# EAGLE design plaits_v50 (EAGLE 9.6.2)

## Sheet 1 of 5
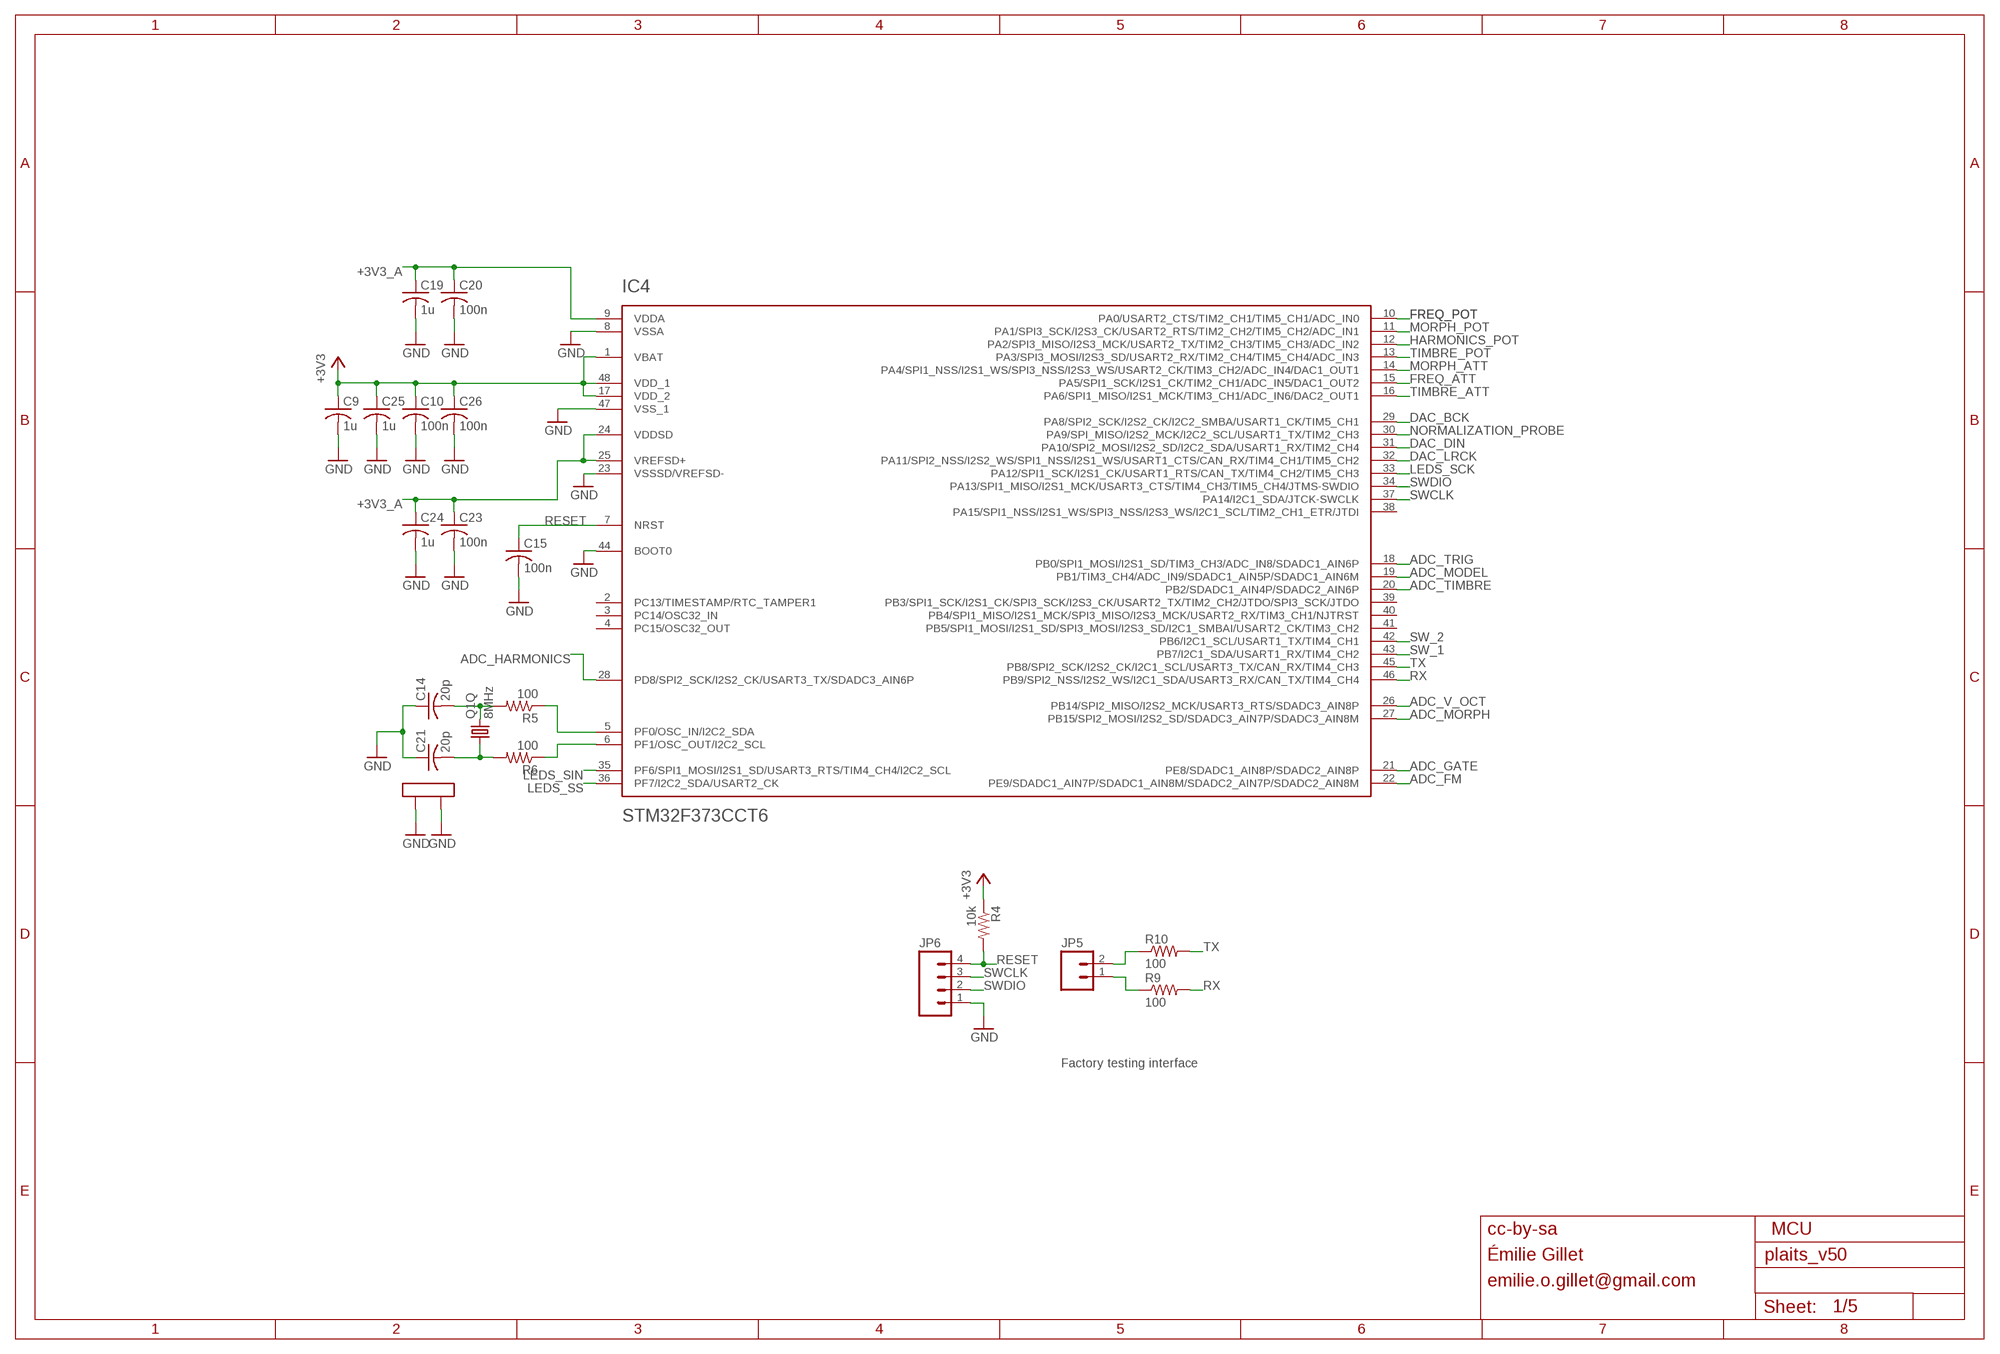
[diagram p0: schematic, sheet 1]

### Parts
C9  1u  C-USC0402  [C0402]
C10  100n  C-USC0402  [C0402]
C14  20p  C-USC0402  [C0402]
C15  100n  C-USC0402  [C0402]
C19  1u  C-USC0402  [C0402]
C20  100n  C-USC0402  [C0402]
C21  20p  C-USC0402  [C0402]
C23  100n  C-USC0402  [C0402]
C24  1u  C-USC0402  [C0402]
C25  1u  C-USC0402  [C0402]
C26  100n  C-USC0402  [C0402]
IC4  STM32F373CCT6  STM32F373C  [LQFP48]
JP5  M02PTH  [1X02]
JP6  M04PTH  [1X04]
Q1  8MHz  CRYSTAL  [CTS406]
R4  10k  R-US_R0402  [R0402]
R5  100  R-US_R0402  [R0402]
R6  100  R-US_R0402  [R0402]
R9  100  R-US_R0402  [R0402]
R10  100  R-US_R0402  [R0402]

### Nets
+3V3: C9.1 C10.1 C25.1 C26.1 IC4.1(VBAT) IC4.17(VDD_2) IC4.48(VDD_1) R4.1 ; also sheet 2,3,4,5
+3V3_A: C19.1 C20.1 C23.1 C24.1 IC4.9(VDDA) IC4.24(VDDSD) IC4.25(VREFSD+) ; also sheet 2,3,4,5
ADC_FM: IC4.22(PE9/SDADC1_AIN7P/SDADC1_AIN8M/SDADC2_AIN7P/SDADC2_AIN8M) ; also sheet 3
ADC_GATE: IC4.21(PE8/SDADC1_AIN8P/SDADC2_AIN8P) ; also sheet 3
ADC_HARMONICS: IC4.28(PD8/SPI2_SCK/I2S2_CK/USART3_TX/SDADC3_AIN6P) ; also sheet 3
ADC_MODEL: IC4.19(PB1/TIM3_CH4/ADC_IN9/SDADC1_AIN5P/SDADC1_AIN6M) ; also sheet 3
ADC_MORPH: IC4.27(PB15/SPI2_MOSI/I2S2_SD/SDADC3_AIN7P/SDADC3_AIN8M) ; also sheet 3
ADC_TIMBRE: IC4.20(PB2/SDADC1_AIN4P/SDADC2_AIN6P) ; also sheet 3
ADC_TRIG: IC4.18(PB0/SPI1_MOSI/I2S1_SD/TIM3_CH3/ADC_IN8/SDADC1_AIN6P) ; also sheet 3
ADC_V_OCT: IC4.26(PB14/SPI2_MISO/I2S2_MCK/USART3_RTS/SDADC3_AIN8P) ; also sheet 3
DAC_BCK: IC4.29(PA8/SPI2_SCK/I2S2_CK/I2C2_SMBA/USART1_CK/TIM5_CH1) ; also sheet 4
DAC_DIN: IC4.31(PA10/SPI2_MOSI/I2S2_SD/I2C2_SDA/USART1_RX/TIM2_CH4) ; also sheet 4
DAC_LRCK: IC4.32(PA11/SPI2_NSS/I2S2_WS/SPI1_NSS/I2S1_WS/USART1_CTS/CAN_RX/TIM4_CH1/TIM5_CH2) ; also sheet 4
FREQ_ATT: IC4.15(PA5/SPI1_SCK/I2S1_CK/TIM2_CH1/ADC_IN5/DAC1_OUT2) ; also sheet 2
FREQ_POT: IC4.10(PA0/USART2_CTS/TIM2_CH1/TIM5_CH1/ADC_IN0) ; also sheet 2
GND: C9.2 C10.2 C14.1 C15.2 C19.2 C20.2 C21.1 C23.2 C24.2 C25.2 C26.2 IC4.8(VSSA) IC4.23(VSSSD/VREFSD-) IC4.44(BOOT0) IC4.47(VSS_1) JP6.1 Q1.2(LID1) Q1.4(LID2) ; also sheet 2,3,4,5
HARMONICS_POT: IC4.12(PA2/SPI3_MISO/I2S3_MCK/USART2_TX/TIM2_CH3/TIM5_CH3/ADC_IN2) ; also sheet 2
LEDS_SCK: IC4.33(PA12/SPI1_SCK/I2S1_CK/USART1_RTS/CAN_TX/TIM4_CH2/TIM5_CH3) ; also sheet 2
LEDS_SIN: IC4.35(PF6/SPI1_MOSI/I2S1_SD/USART3_RTS/TIM4_CH4/I2C2_SCL) ; also sheet 2
LEDS_SS: IC4.36(PF7/I2C2_SDA/USART2_CK) ; also sheet 2
MORPH_ATT: IC4.14(PA4/SPI1_NSS/I2S1_WS/SPI3_NSS/I2S3_WS/USART2_CK/TIM3_CH2/ADC_IN4/DAC1_OUT1) ; also sheet 2
MORPH_POT: IC4.11(PA1/SPI3_SCK/I2S3_CK/USART2_RTS/TIM2_CH2/TIM5_CH2/ADC_IN1) ; also sheet 2
N$7: IC4.5(PF0/OSC_IN/I2C2_SDA) R5.1
N$8: IC4.6(PF1/OSC_OUT/I2C2_SCL) R6.1
N$29: C14.2 Q1.3 R5.2
N$33: JP5.2 R10.1
N$35: C21.2 Q1.1 R6.2
N$51: JP5.1 R9.1
NORMALIZATION_PROBE: IC4.30(PA9/SPI_MISO/I2S2_MCK/I2C2_SCL/USART1_TX/TIM2_CH3) ; also sheet 3
RESET: C15.1 IC4.7(NRST) JP6.4 R4.2
RX: IC4.46(PB9/SPI2_NSS/I2S2_WS/I2C1_SDA/USART3_RX/CAN_TX/TIM4_CH4) R9.2
SW_1: IC4.43(PB7/I2C1_SDA/USART1_RX/TIM4_CH2) ; also sheet 2
SW_2: IC4.42(PB6/I2C1_SCL/USART1_TX/TIM4_CH1) ; also sheet 2
SWCLK: IC4.37(PA14/I2C1_SDA/JTCK-SWCLK) JP6.3
SWDIO: IC4.34(PA13/SPI1_MISO/I2S1_MCK/USART3_CTS/TIM4_CH3/TIM5_CH4/JTMS-SWDIO) JP6.2
TIMBRE_ATT: IC4.16(PA6/SPI1_MISO/I2S1_MCK/TIM3_CH1/ADC_IN6/DAC2_OUT1) ; also sheet 2
TIMBRE_POT: IC4.13(PA3/SPI3_MOSI/I2S3_SD/USART2_RX/TIM2_CH4/TIM5_CH4/ADC_IN3) ; also sheet 2
TX: IC4.45(PB8/SPI2_SCK/I2S2_CK/I2C1_SCL/USART3_TX/CAN_RX/TIM4_CH3) R10.2
Unconnected: IC4.2(PC13/TIMESTAMP/RTC_TAMPER1) IC4.3(PC14/OSC32_IN) IC4.4(PC15/OSC32_OUT) IC4.38(PA15/SPI1_NSS/I2S1_WS/SPI3_NSS/I2S3_WS/I2C1_SCL/TIM2_CH1_ETR/JTDI) IC4.39(PB3/SPI1_SCK/I2S1_CK/SPI3_SCK/I2S3_CK/USART2_TX/TIM2_CH2/JTDO/SPI3_SCK/JTDO) IC4.40(PB4/SPI1_MISO/I2S1_MCK/SPI3_MISO/I2S3_MCK/USART2_RX/TIM3_CH1/NJTRST) IC4.41(PB5/SPI1_MOSI/I2S1_SD/SPI3_MOSI/I2S3_SD/I2C1_SMBAI/USART2_CK/TIM3_CH2)

### Notes on the sheet
- Factory testing interface
- cc-by-sa | MCU
- Émilie Gillet
- emilie.o.gillet@gmail.com

## Sheet 2 of 5
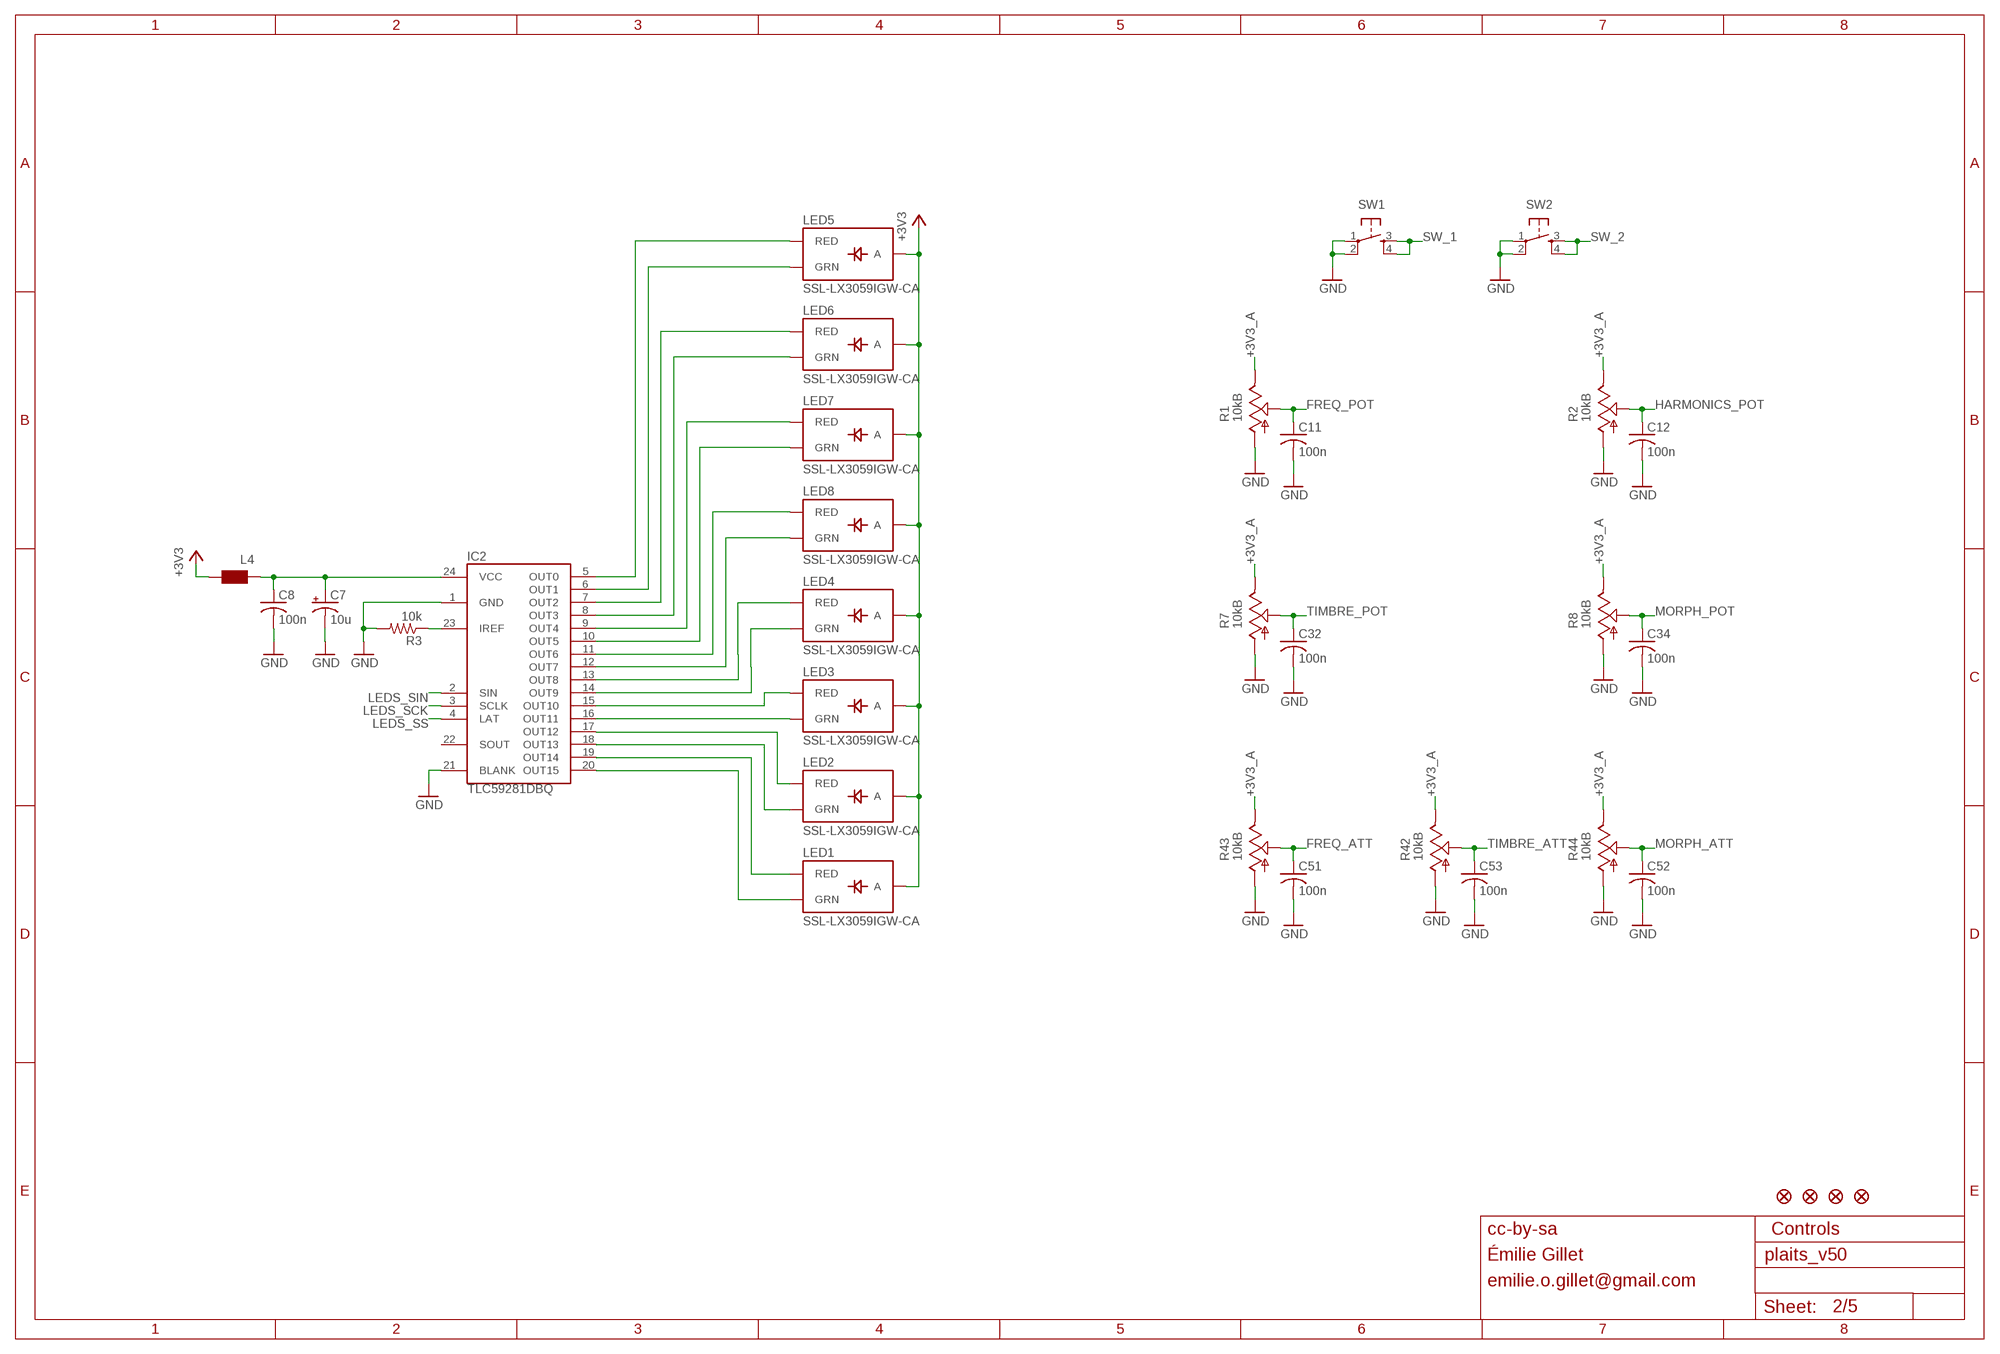
[diagram p1: schematic, sheet 2]

### Parts
C7  10u  CPOL-USA  [PANASONIC_A]
C8  100n  C-USC0402  [C0402]
C11  100n  C-USC0402  [C0402]
C12  100n  C-USC0402  [C0402]
C32  100n  C-USC0402  [C0402]
C34  100n  C-USC0402  [C0402]
C51  100n  C-USC0402  [C0402]
C52  100n  C-USC0402  [C0402]
C53  100n  C-USC0402  [C0402]
IC2  TLC59281DBQ  [TSSOP24_0635]
JP1  FIDUCIAL1X2  [FIDUCIAL-1X2]
JP2  FIDUCIAL1X2  [FIDUCIAL-1X2]
JP3  FIDUCIAL1X2  [FIDUCIAL-1X2]
JP4  FIDUCIAL1X2  [FIDUCIAL-1X2]
L4  WE-CBF_0603  [0603]
LED1  SSL-LX3059IGW-CA  LED-BICOLOR-THROUGHHOLE-CA  [LED-BICOLOR-THROUGHHOLE-LUMEX]
LED2  SSL-LX3059IGW-CA  LED-BICOLOR-THROUGHHOLE-CA  [LED-BICOLOR-THROUGHHOLE-LUMEX]
LED3  SSL-LX3059IGW-CA  LED-BICOLOR-THROUGHHOLE-CA  [LED-BICOLOR-THROUGHHOLE-LUMEX]
LED4  SSL-LX3059IGW-CA  LED-BICOLOR-THROUGHHOLE-CA  [LED-BICOLOR-THROUGHHOLE-LUMEX]
LED5  SSL-LX3059IGW-CA  LED-BICOLOR-THROUGHHOLE-CA  [LED-BICOLOR-THROUGHHOLE-LUMEX]
LED6  SSL-LX3059IGW-CA  LED-BICOLOR-THROUGHHOLE-CA  [LED-BICOLOR-THROUGHHOLE-LUMEX]
LED7  SSL-LX3059IGW-CA  LED-BICOLOR-THROUGHHOLE-CA  [LED-BICOLOR-THROUGHHOLE-LUMEX]
LED8  SSL-LX3059IGW-CA  LED-BICOLOR-THROUGHHOLE-CA  [LED-BICOLOR-THROUGHHOLE-LUMEX]
R1  10kB  POT_USVERTICAL_PS  [ALPS_POT_VERTICAL_PS]
R2  10kB  POT_USVERTICAL_PS  [ALPS_POT_VERTICAL_PS]
R3  10k  R-US_R0402  [R0402]
R7  10kB  POT_USVERTICAL_PS  [ALPS_POT_VERTICAL_PS]
R8  10kB  POT_USVERTICAL_PS  [ALPS_POT_VERTICAL_PS]
R42  10kB  POT_USVERTICAL  [ALPS_POT_VERTICAL]
R43  10kB  POT_USVERTICAL  [ALPS_POT_VERTICAL]
R44  10kB  POT_USVERTICAL  [ALPS_POT_VERTICAL]
SW1  TAC_SWITCHPTH  [TACTILE-PTH]
SW2  TAC_SWITCHPTH  [TACTILE-PTH]

### Nets
+3V3: L4.2 LED1.A LED2.A LED3.A LED4.A LED5.A LED6.A LED7.A LED8.A ; also sheet 1,3,4,5
+3V3_A: R1.P$1(E) R2.P$1(E) R7.P$1(E) R8.P$1(E) R42.P$1(E) R43.P$1(E) R44.P$1(E) ; also sheet 1,3,4,5
FREQ_ATT: C51.1 R43.P$2(S) ; also sheet 1
FREQ_POT: C11.1 R1.P$2(S) ; also sheet 1
GND: C7.- C8.2 C11.2 C12.2 C32.2 C34.2 C51.2 C52.2 C53.2 IC2.1(GND) IC2.21(BLANK) R1.P$3(A) R2.P$3(A) R3.2 R7.P$3(A) R8.P$3(A) R42.P$3(A) R43.P$3(A) R44.P$3(A) SW1.1 SW1.2 SW2.1 SW2.2 ; also sheet 1,3,4,5
HARMONICS_POT: C12.1 R2.P$2(S) ; also sheet 1
LEDS_SCK: IC2.3(SCLK) ; also sheet 1
LEDS_SIN: IC2.2(SIN) ; also sheet 1
LEDS_SS: IC2.4(LAT) ; also sheet 1
MORPH_ATT: C52.1 R44.P$2(S) ; also sheet 1
MORPH_POT: C34.1 R8.P$2(S) ; also sheet 1
N$2: IC2.12(OUT7) LED8.GREEN_C(GRN)
N$5: IC2.11(OUT6) LED8.RED_C(RED)
N$9: IC2.10(OUT5) LED7.GREEN_C(GRN)
N$10: IC2.9(OUT4) LED7.RED_C(RED)
N$11: IC2.8(OUT3) LED6.GREEN_C(GRN)
N$12: IC2.13(OUT8) LED4.RED_C(RED)
N$13: IC2.7(OUT2) LED6.RED_C(RED)
N$14: IC2.14(OUT9) LED4.GREEN_C(GRN)
N$15: IC2.6(OUT1) LED5.GREEN_C(GRN)
N$17: IC2.15(OUT10) LED3.RED_C(RED)
N$18: IC2.16(OUT11) LED3.GREEN_C(GRN)
N$19: IC2.17(OUT12) LED2.RED_C(RED)
N$20: IC2.18(OUT13) LED2.GREEN_C(GRN)
N$21: IC2.19(OUT14) LED1.RED_C(RED)
N$22: IC2.5(OUT0) LED5.RED_C(RED)
N$23: IC2.20(OUT15) LED1.GREEN_C(GRN)
N$27: C7.+ C8.1 IC2.24(VCC) L4.1
N$68: IC2.23(IREF) R3.1
SW_1: SW1.3 SW1.4 ; also sheet 1
SW_2: SW2.3 SW2.4 ; also sheet 1
TIMBRE_ATT: C53.1 R42.P$2(S) ; also sheet 1
TIMBRE_POT: C32.1 R7.P$2(S) ; also sheet 1
Unconnected: IC2.22(SOUT)

### Notes on the sheet
- cc-by-sa | Controls
- Émilie Gillet
- emilie.o.gillet@gmail.com

## Sheet 3 of 5
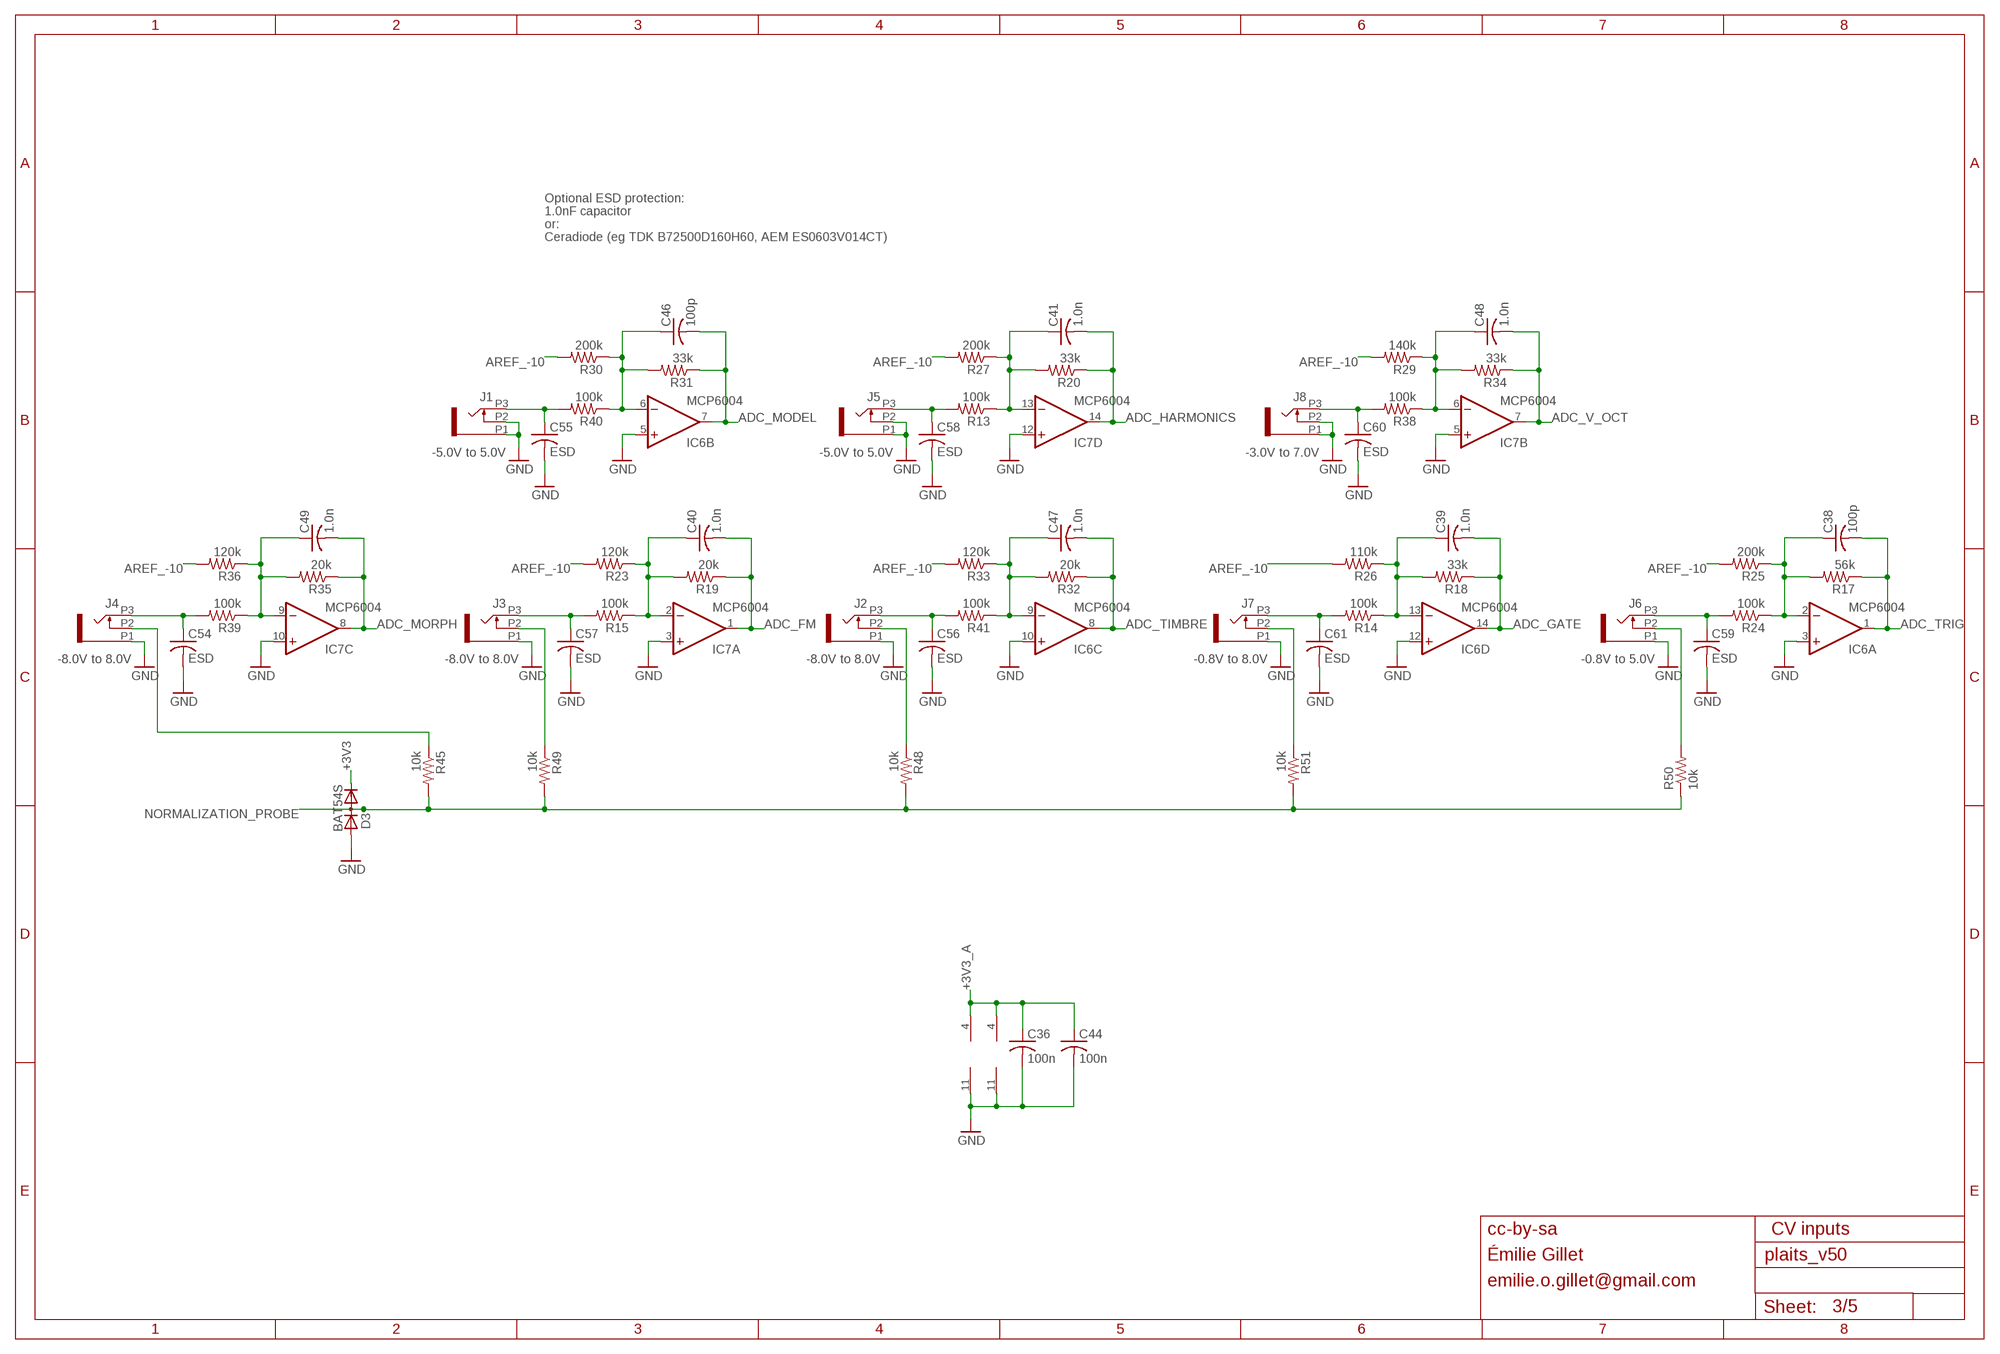
[diagram p2: schematic, sheet 3]

### Parts
C36  100n  C-USC0402  [C0402]
C38  100p  C-USC0402  [C0402]
C39  1.0n  C-USC0402  [C0402]
C40  1.0n  C-USC0402  [C0402]
C41  1.0n  C-USC0402  [C0402]
C44  100n  C-USC0402  [C0402]
C46  100p  C-USC0402  [C0402]
C47  1.0n  C-USC0402  [C0402]
C48  1.0n  C-USC0402  [C0402]
C49  1.0n  C-USC0402  [C0402]
C54  ESD  C-USC0603  [C0603]
C55  ESD  C-USC0603  [C0603]
C56  ESD  C-USC0603  [C0603]
C57  ESD  C-USC0603  [C0603]
C58  ESD  C-USC0603  [C0603]
C59  ESD  C-USC0603  [C0603]
C60  ESD  C-USC0603  [C0603]
C61  ESD  C-USC0603  [C0603]
D3  BAT54S  DIODE_2CACA-SOT23  [SOT23]
IC6  MCP6004  TL074PW  [TSSOP14_065]
IC7  MCP6004  TL074PW  [TSSOP14_065]
J1  PJ301_THONKICONN6  [WQP_PJ_301M6]
J2  PJ301_THONKICONN6  [WQP_PJ_301M6]
J3  PJ301_THONKICONN6  [WQP_PJ_301M6]
J4  PJ301_THONKICONN6  [WQP_PJ_301M6]
J5  PJ301_THONKICONN6  [WQP_PJ_301M6]
J6  PJ301_THONKICONN6  [WQP_PJ_301M6]
J7  PJ301_THONKICONN6  [WQP_PJ_301M6]
J8  PJ301_THONKICONN6  [WQP_PJ_301M6]
R13  100k  R-US_R0402  [R0402]
R14  100k  R-US_R0402  [R0402]
R15  100k  R-US_R0402  [R0402]
R17  56k  R-US_R0402  [R0402]
R18  33k  R-US_R0402  [R0402]
R19  20k  R-US_R0402  [R0402]
R20  33k  R-US_R0402  [R0402]
R23  120k  R-US_R0402  [R0402]
R24  100k  R-US_R0402  [R0402]
R25  200k  R-US_R0402  [R0402]
R26  110k  R-US_R0402  [R0402]
R27  200k  R-US_R0402  [R0402]
R29  140k  R-US_R0402  [R0402]
R30  200k  R-US_R0402  [R0402]
R31  33k  R-US_R0402  [R0402]
R32  20k  R-US_R0402  [R0402]
R33  120k  R-US_R0402  [R0402]
R34  33k  R-US_R0402  [R0402]
R35  20k  R-US_R0402  [R0402]
R36  120k  R-US_R0402  [R0402]
R38  100k  R-US_R0402  [R0402]
R39  100k  R-US_R0402  [R0402]
R40  100k  R-US_R0402  [R0402]
R41  100k  R-US_R0402  [R0402]
R45  10k  R-US_R0402  [R0402]
R48  10k  R-US_R0402  [R0402]
R49  10k  R-US_R0402  [R0402]
R50  10k  R-US_R0402  [R0402]
R51  10k  R-US_R0402  [R0402]

### Nets
+3V3: D3.2(C) ; also sheet 1,2,4,5
+3V3_A: C36.1 C44.1 IC6.4(P:V+) IC7.4(P:V+) ; also sheet 1,2,4,5
ADC_FM: C40.2 IC7.1(A:OUT) R19.1 ; also sheet 1
ADC_GATE: C39.2 IC6.14(D:OUT) R18.1 ; also sheet 1
ADC_HARMONICS: C41.2 IC7.14(D:OUT) R20.1 ; also sheet 1
ADC_MODEL: C46.2 IC6.7(B:OUT) R31.1 ; also sheet 1
ADC_MORPH: C49.2 IC7.8(C:OUT) R35.1 ; also sheet 1
ADC_TIMBRE: C47.2 IC6.8(C:OUT) R32.1 ; also sheet 1
ADC_TRIG: C38.2 IC6.1(A:OUT) R17.1 ; also sheet 1
ADC_V_OCT: C48.2 IC7.7(B:OUT) R34.1 ; also sheet 1
AREF_-10: R23.2 R25.2 R26.2 R27.2 R29.2 R30.2 R33.2 R36.2 ; also sheet 5
FM_IN: C57.1 J3.P3 R15.2
GATE_IN: C61.1 J7.P3 R14.2
GATE_IN1: C59.1 J6.P3 R24.2
GND: C36.2 C44.2 C54.2 C55.2 C56.2 C57.2 C58.2 C59.2 C60.2 C61.2 D3.1(A) IC6.3(A:+IN) IC6.5(B:+IN) IC6.10(C:+IN) IC6.11(P:V-) IC6.12(D:+IN) IC7.3(A:+IN) IC7.5(B:+IN) IC7.10(C:+IN) IC7.11(P:V-) IC7.12(D:+IN) J1.P1 J1.P2 J2.P1 J3.P1 J4.P1 J5.P1 J5.P2 J6.P1 J7.P1 J8.P1 J8.P2 ; also sheet 1,2,4,5
HARMONICS_IN: C58.1 J5.P3 R13.2
MODEL_IN: C55.1 J1.P3 R40.2
MORPH_IN: C54.1 J4.P3 R39.2
N$3: J6.P2 R50.2
N$4: C38.1 IC6.2(A:-IN) R17.2 R24.1 R25.1
N$24: J3.P2 R49.1
N$25: J2.P2 R48.1
N$26: J4.P2 R45.1
N$28: C39.1 IC6.13(D:-IN) R14.1 R18.2 R26.1
N$30: C48.1 IC7.6(B:-IN) R29.1 R34.2 R38.1
N$31: C56.1 J2.P3 R41.2
N$32: C49.1 IC7.9(C:-IN) R35.2 R36.1 R39.1
N$34: C40.1 IC7.2(A:-IN) R15.1 R19.2 R23.1
N$36: J7.P2 R51.1
N$37: C46.1 IC6.6(B:-IN) R30.1 R31.2 R40.1
N$39: C47.1 IC6.9(C:-IN) R32.2 R33.1 R41.1
N$41: C41.1 IC7.13(D:-IN) R13.1 R20.2 R27.1
NORMALIZATION_PROBE: D3.3(AC) R45.2 R48.2 R49.2 R50.1 R51.2 ; also sheet 1
V_OCT_IN: C60.1 J8.P3 R38.2

### Notes on the sheet
- Optional ESD protection:
- 1.0nF capacitor
- or:
- Ceradiode (eg TDK B72500D160H60, AEM ES0603V014CT)
- -5.0V to 5.0V | -5.0V to 5.0V | -3.0V to 7.0V
- -8.0V to 8.0V | -8.0V to 8.0V | -8.0V to 8.0V | -0.8V to 8.0V | -0.8V to 5.0V
- cc-by-sa | CV inputs
- Émilie Gillet
- emilie.o.gillet@gmail.com

## Sheet 4 of 5
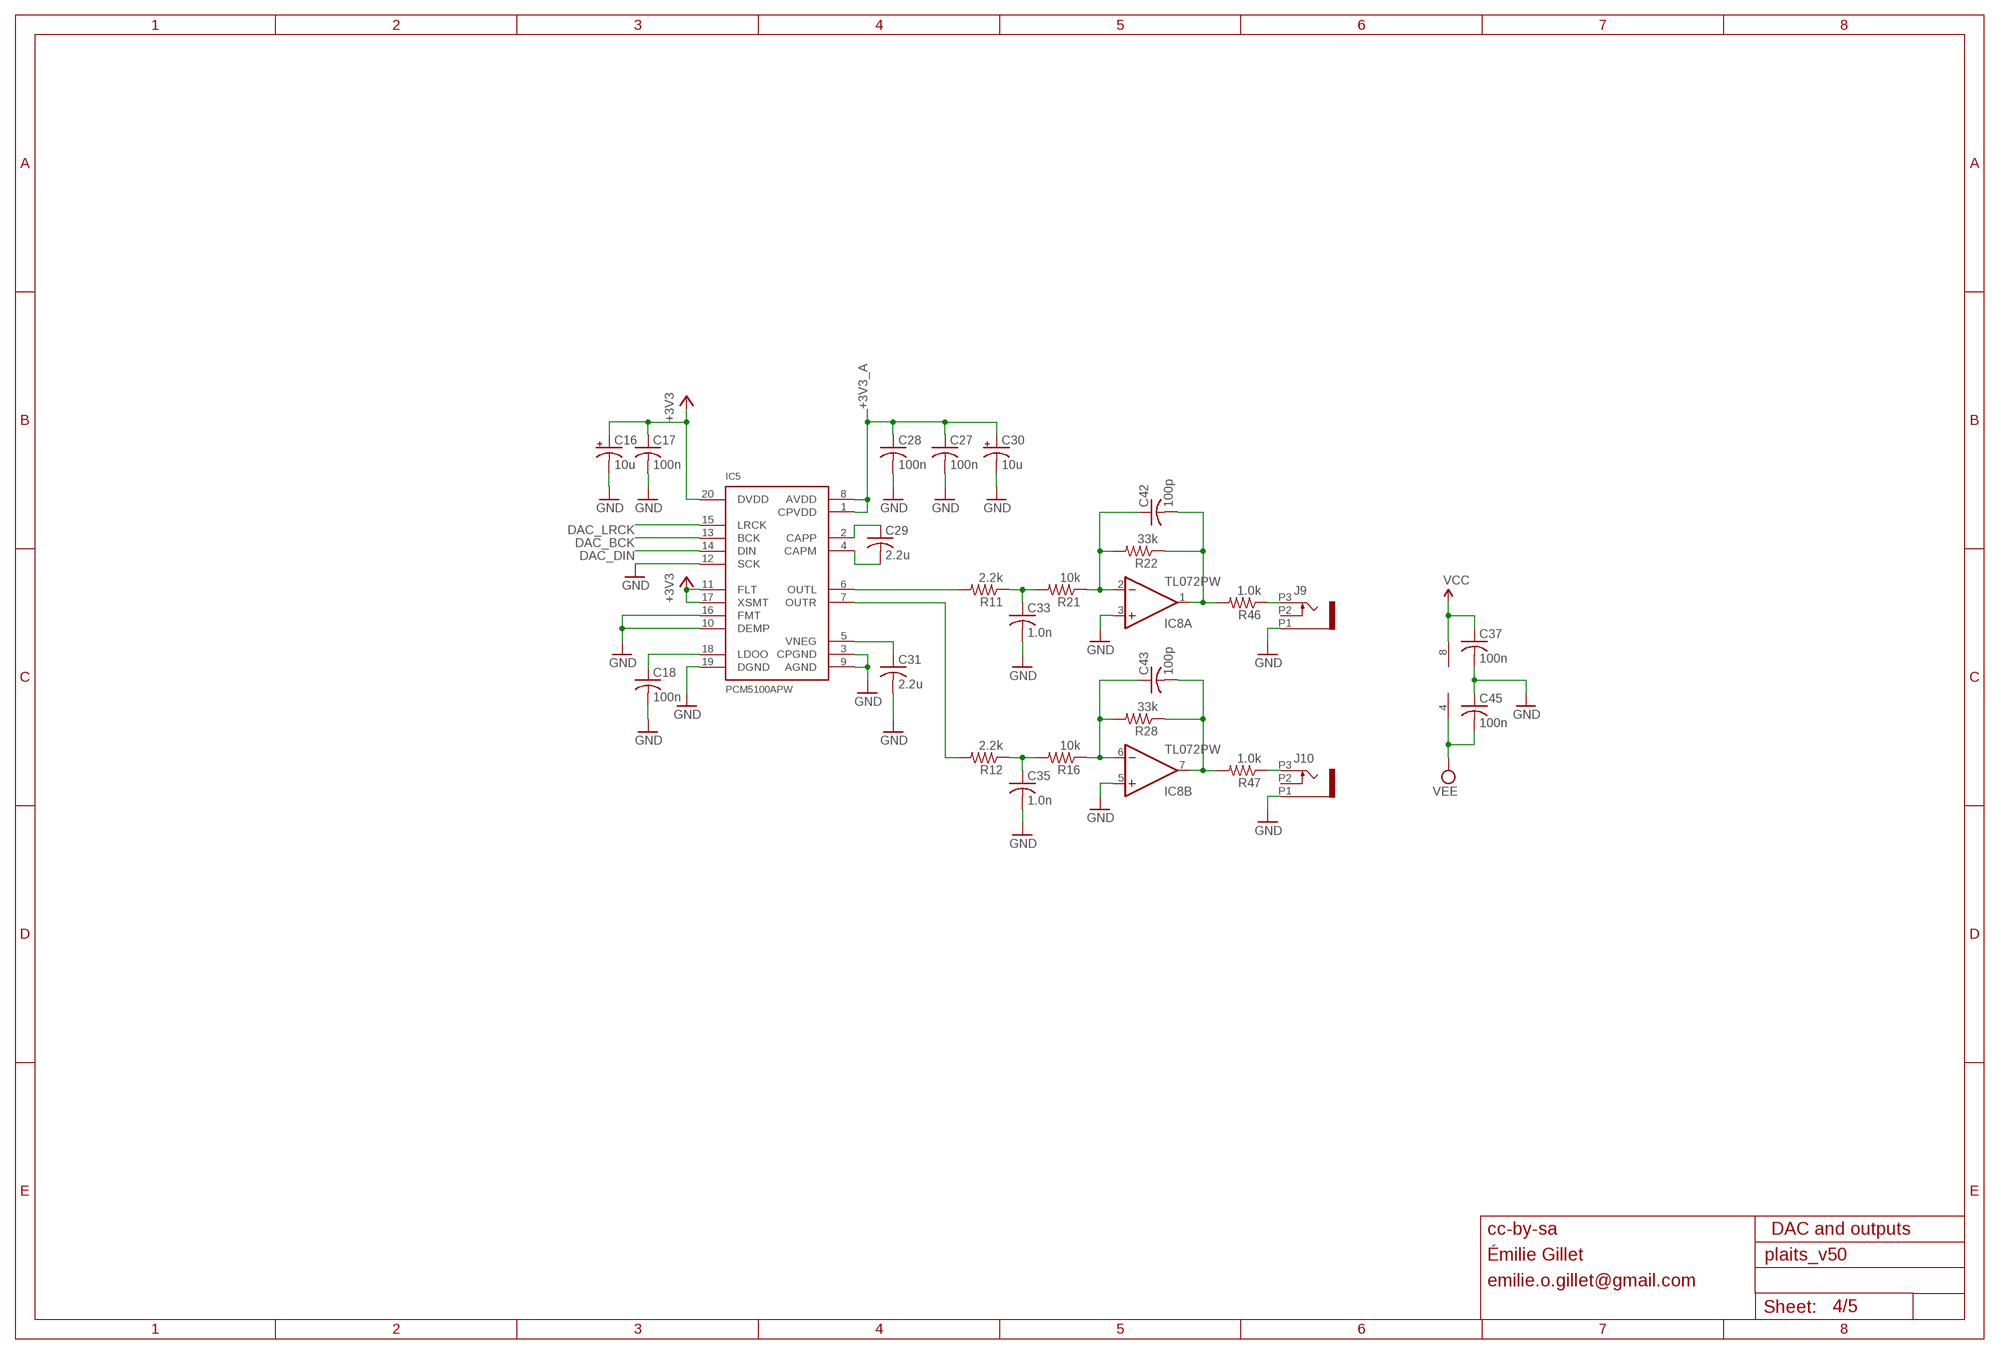
[diagram p3: schematic, sheet 4]

### Parts
C16  10u  CPOL-USA  [PANASONIC_A]
C17  100n  C-USC0402  [C0402]
C18  100n  C-USC0402  [C0402]
C27  100n  C-USC0402  [C0402]
C28  100n  C-USC0402  [C0402]
C29  2.2u  C-USC0805  [C0805]
C30  10u  CPOL-USA  [PANASONIC_A]
C31  2.2u  C-USC0805  [C0805]
C33  1.0n  C-USC0402  [C0402]
C35  1.0n  C-USC0402  [C0402]
C37  100n  C-USC0402  [C0402]
C42  100p  C-USC0402  [C0402]
C43  100p  C-USC0402  [C0402]
C45  100n  C-USC0402  [C0402]
IC5  PCM5100APW  PCM5100PW  [SSOP20]
IC8  TL072PW  [TSSOP08]
J9  PJ301_THONKICONN6  [WQP_PJ_301M6]
J10  PJ301_THONKICONN6  [WQP_PJ_301M6]
R11  2.2k  R-US_R0402  [R0402]
R12  2.2k  R-US_R0402  [R0402]
R16  10k  R-US_R0402  [R0402]
R21  10k  R-US_R0402  [R0402]
R22  33k  R-US_R0402  [R0402]
R28  33k  R-US_R0402  [R0402]
R46  1.0k  R-US_R0603  [R0603]
R47  1.0k  R-US_R0603  [R0603]

### Nets
+3V3: C16.+ C17.1 IC5.11(FLT) IC5.17(XSMT) IC5.20(DVDD) ; also sheet 1,2,3,5
+3V3_A: C27.1 C28.1 C30.+ IC5.1(CPVDD) IC5.8(AVDD) ; also sheet 1,2,3,5
DAC_BCK: IC5.13(BCK) ; also sheet 1
DAC_DIN: IC5.14(DIN) ; also sheet 1
DAC_LRCK: IC5.15(LRCK) ; also sheet 1
GND: C16.- C17.2 C18.2 C27.2 C28.2 C30.- C31.2 C33.2 C35.2 C37.2 C45.1 IC5.3(CPGND) IC5.9(AGND) IC5.10(DEMP) IC5.12(SCK) IC5.16(FMT) IC5.19(DGND) IC8.3(A:+IN) IC8.5(B:+IN) J9.P1 J10.P1 ; also sheet 1,2,3,5
N$6: C29.1 IC5.2(CAPP)
N$16: C29.2 IC5.4(CAPM)
N$43: IC5.6(OUTL) R11.2
N$46: C33.1 R11.1 R21.2
N$47: C35.1 R12.1 R16.2
N$48: C31.1 IC5.5(VNEG)
N$54: C18.1 IC5.18(LDOO)
N$55: IC5.7(OUTR) R12.2
N$58: C43.1 IC8.6(B:-IN) R16.1 R28.2
N$60: C43.2 IC8.7(B:OUT) R28.1 R47.2
N$62: C42.1 IC8.2(A:-IN) R21.1 R22.2
N$63: C42.2 IC8.1(A:OUT) R22.1 R46.2
N$65: J9.P3 R46.1
N$69: J10.P3 R47.1
VCC: C37.1 IC8.8(P:V+) ; also sheet 5
VEE: C45.2 IC8.4(P:V-) ; also sheet 5
Unconnected: J9.P2 J10.P2

### Notes on the sheet
- cc-by-sa | DAC and outputs
- Émilie Gillet
- emilie.o.gillet@gmail.com

## Sheet 5 of 5
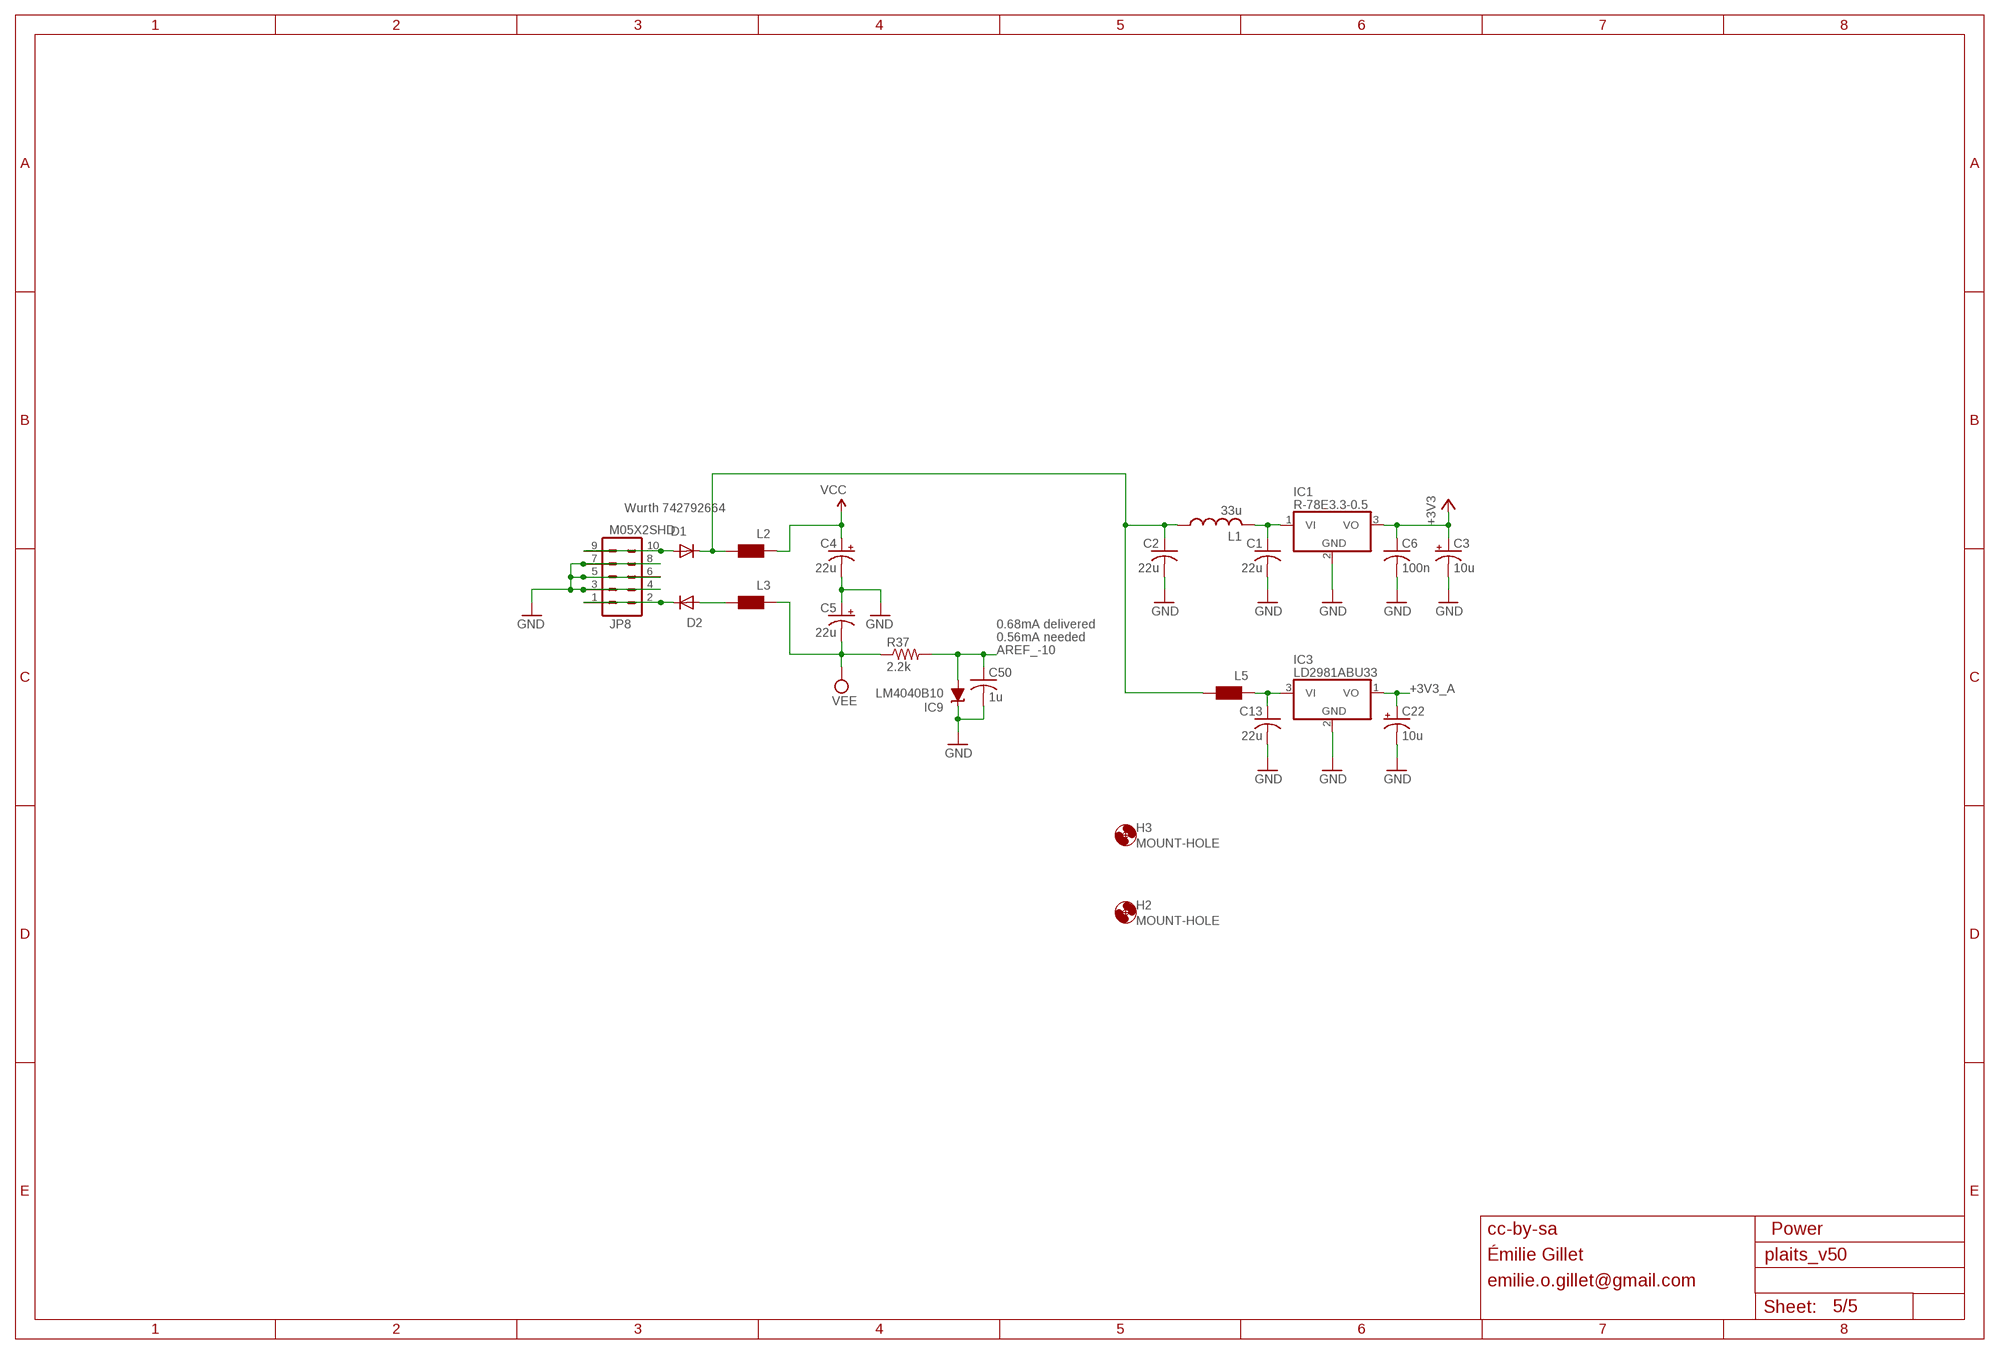
[diagram p4: schematic, sheet 5]

### Parts
C1  22u  C-USC1206  [C1206]
C2  22u  C-USC1206  [C1206]
C3  10u  CPOL-USA  [PANASONIC_A]
C4  22u  CPOL-USB  [PANASONIC_B]
C5  22u  CPOL-USB  [PANASONIC_B]
C6  100n  C-USC0402  [C0402]
C13  22u  C-USC1206  [C1206]
C22  10u  CPOL-USA  [PANASONIC_A]
C50  1u  C-USC0402  [C0402]
D1  1N5819HW  DIODE-SOD123  [SOD123]
D2  1N5819HW  DIODE-SOD123  [SOD123]
H2  MOUNT-HOLE  MOUNT-HOLE3.0TINY  [3,0TINY]
H3  MOUNT-HOLE  MOUNT-HOLE3.0TINY  [3,0TINY]
IC1  R-78E3.3-0.5  WE173950378  [WE78]
IC3  LD2981ABU33  LD2981ABU  [SOT89]
IC9  LM4040B10  LM4041B12DBZ  [DBZ_R-PDSO-G3]
JP8  M05X2SHD  [2X5-SHROUDED]
L1  33u  L-USL2012C  [L2012C]
L2  WE-CBF_0603  [0603]
L3  WE-CBF_0603  [0603]
L5  WE-CBF_0603  [0603]
R37  2.2k  R-US_R0402  [R0402]

### Nets
+3V3: C3.+ C6.1 IC1.3(VO) ; also sheet 1,2,3,4
+3V3_A: C22.+ IC3.1(VO) ; also sheet 1,2,3,4
AREF_-10: C50.1 IC9.2(A) R37.2 ; also sheet 3
GND: C1.2 C2.2 C3.- C4.- C5.+ C6.2 C13.2 C22.- C50.2 IC1.2(GND) IC3.2(GND) IC9.1(C) JP8.3 JP8.4 JP8.5 JP8.6 JP8.7 JP8.8 ; also sheet 1,2,3,4
N$1: C1.1 IC1.1(VI) L1.2
N$38: D2.A L3.2
N$40: C2.1 D1.C L1.1 L2.2 L5.2
N$42: C13.1 IC3.3(VI) L5.1
N$56: D1.A JP8.9 JP8.10
N$64: D2.C JP8.1 JP8.2
VCC: C4.+ L2.1 ; also sheet 4
VEE: C5.- L3.1 R37.1 ; also sheet 4

### Notes on the sheet
- Wurth 742792664
- 0.68mA delivered
- 0.56mA needed
- cc-by-sa | Power
- Émilie Gillet
- emilie.o.gillet@gmail.com

## Library data of the parts
C1 C2 C6 C8-C15 C17-C21 C23-C29 C31-C61 = rcl:C-US: CAPACITOR, American symbol
C3-C5 C7 C16 C22 C30 = rcl:CPOL-US: POLARIZED CAPACITOR, American symbol
D1 D2 = diode:DIODE-: DIODE
D3 = diode:DIODE_2CACA-: 2 Diodes - Cathode-Anode|Cathode-Anode
H2 H3 = og-holes:MOUNT-HOLE: MOUNTING HOLE with drill center marker
IC1 = og-vreg:WE173950378
IC2 = og-ics:TLC59281
IC3 = og-vreg:LD2981
IC4 = og-stm32f2:STM32F373C
IC5 = og-dac:PCM5100
IC6 IC7 = og-linear:TL074: OP AMP
IC8 = og-linear:TL072: OP AMP
IC9 = texas:LM4041: PRECISION MICROPOWER SHUNT VOLTAGE REFERENCE Source: http://focus.ti.com/lit/ds/slcs146e/slcs146e.pdf
J1-J10 = og-pj301_variations:PJ301_THONKICONN
JP1-JP4 = SparkFun:FIDUCIAL: Fiducial Alignment Points Various fiducial points for machine vision alignment.
JP5 = SparkFun:M02: Header 2 Standard 2-pin 0.1" header. Use with straight break away headers (SKU : PRT-00116), right angle break away headers (PRT-00553), swiss pins (PRT-00743), machine pins (PRT-00117), and female headers (PRT-00115). Molex polarized connector foot print use with SKU : PRT-08233 with associated crimp pins and housings.
JP6 = SparkFun:M04: Header 4 Standard 4-pin 0.1" header. Use with straight break away headers (SKU : PRT-00116), right angle break away headers (PRT-00553), swiss pins (PRT-00743), machine pins (PRT-00117), and female headers (PRT-00115). Molex polarized connector foot print use with SKU : PRT-08231 with associated crimp pins and housings.
JP8 = og-header:M05X2: Header 5x2 Standard 10-pin dual row 0.1" header. Commonly used with AVR-ISP. Use with Spark Fun Electronics SKU: PRT-00778
L1 = og-rcl:L-US
L2-L5 = wuerth-elektronik:WE-CBF: SMD EMI Suppression Ferrite Beads - excellent anti-EMI properties - low DCR - impedances till 3000 ohms - rated current up to 6 A
LED1-LED8 = og-leds:LED-BICOLOR-THROUGHHOLE-CA
Q1 = og-crystal:CRYSTAL: Crystal with 2 extra terminals for the metal LID (Abracon ABMM2 for example)
R1 R2 R7 R8 R42-R44 = og-pots:POT_US
R3-R6 R9-R41 R45-R51 = rcl:R-US_: RESISTOR, American symbol
SW1 SW2 = SparkFun:TAC_SWITCH: Momentary Switch Button commonly used for reset or general input. Spark Fun Electronics SKU : COM-00097

## Board
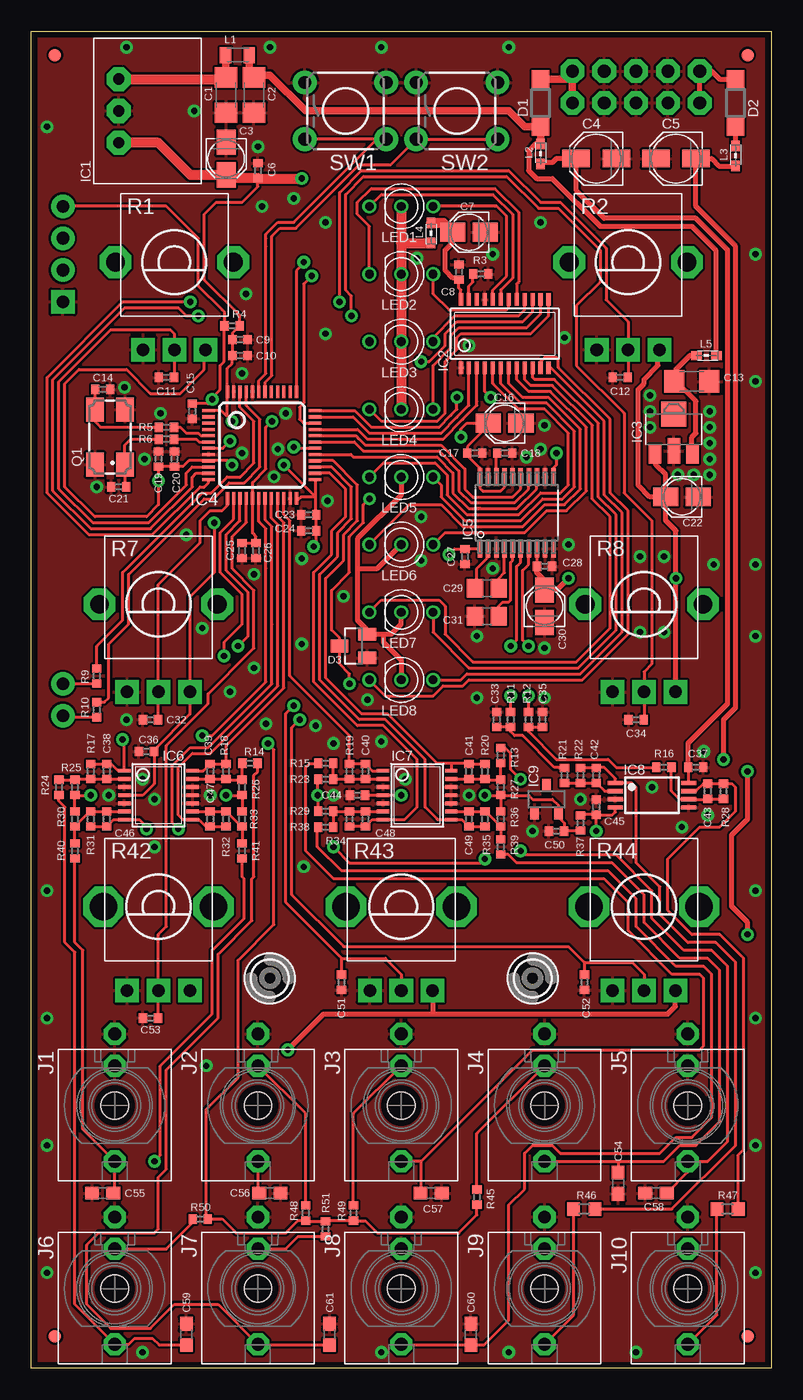
[diagram p5: board, top side]
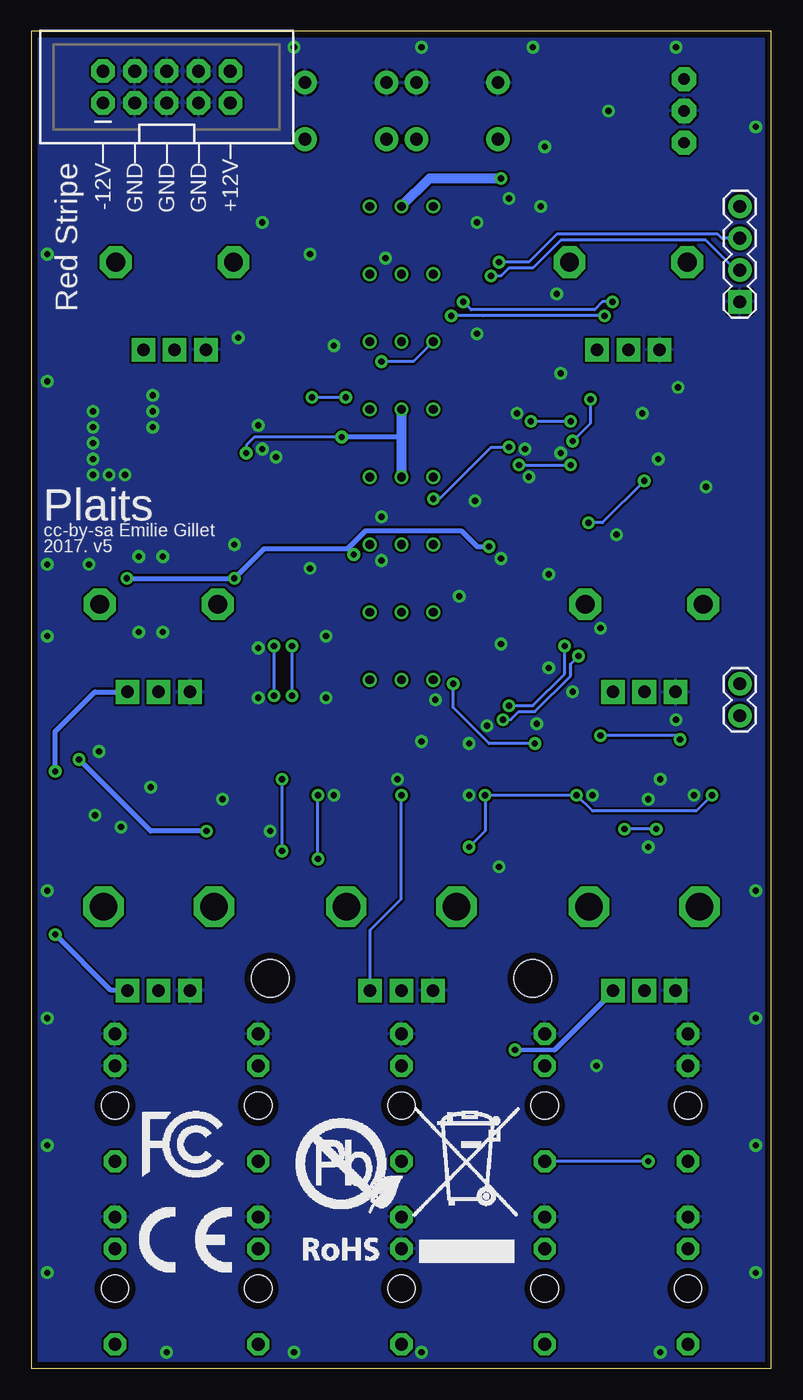
[diagram p6: board, bottom side, seen from below]

Size 59.03 x 106.68 mm. Coordinates in mm from the lower left corner, seen from the top.
Outline: 59.03,0 0,0 0,106.68 59.03,106.68 59.03,0
Copper layers (1*16): Top 0.035mm / dielectric 1.5mm / Bottom 0.035mm
Design rules "PCBCart-Standard": minimum track width 8mil, minimum drill 0.4mm, track to track 7mil, track to pad 7mil, pad to pad 7mil, via to via 7mil, smd to smd 7mil, copper to edge 20mil, drill to drill 8mil, minimum pad ring 8mil, minimum via ring 10mil, stop-mask expansion 3mil, vias tented up to drill 25mil, thermal gap 8mil

### Footprints (pad centres in the part's own frame; a part is rotated, then mirrored left to right if it is on the bottom)
C1206 = smd 1.6 x 1.8: 1 -1.4,0; 2 1.4,0
PANASONIC_A = smd 2 x 1.5: + 1.3,0; - -1.3,0
PANASONIC_B = smd 2.2 x 1.4: + 1.6,0; - -1.6,0
C0402 = smd 0.65 x 0.75: 1 -0.6,0; 2 0.6,0
C0805 = smd 1.3 x 1.5: 1 -0.95,0; 2 0.95,0
C0603 = smd 1.1 x 1: 1 -0.85,0; 2 0.85,0
SOD123 = smd 1.4 x 1.4: A 1.9,0; C -1.9,0
SOT23 = smd 1 x 1.4: 1 -0.95,-1.1; 2 0.95,-1.1; 3 0,1.1
3,0TINY = hole 3: 0,0
WE78 = drill 0.9 pad 1.93 octagon: 1 -2.54,0; 2 0,0; 3 2.54,0
TSSOP24_0635 = smd 0.33 x 1: 1 -3.493,-2.725; 2 -2.857,-2.725; 3 -2.223,-2.725; 4 -1.587,-2.725; 5 -0.953,-2.725; 6 -0.318,-2.725; 7 0.318,-2.725; 8 0.953,-2.725; 9 1.587,-2.725; 10 2.223,-2.725; 11 2.857,-2.725; 12 3.493,-2.725; 13 3.493,2.725; 14 2.857,2.725; 15 2.223,2.725; 16 1.587,2.725; 17 0.953,2.725; 18 0.318,2.725; 19 -0.318,2.725; 20 -0.953,2.725; 21 -1.587,2.725; 22 -2.223,2.725; 23 -2.857,2.725; 24 -3.493,2.725
SOT89 = smd 1 x 1.5: 1 -1.499,-1.981; 3 1.499,-1.981 | smd 1 x 2: 2 0,-1.727 | smd 2 x 2: 2@1 0,1.194
LQFP48 = smd 0.254 x 1: 1 -2.75,-4.25; 2 -2.25,-4.25; 3 -1.75,-4.25; 4 -1.25,-4.25; 5 -0.75,-4.25; 6 -0.25,-4.25; 7 0.25,-4.25; 8 0.75,-4.25; 9 1.25,-4.25; 10 1.75,-4.25; 11 2.25,-4.25; 12 2.75,-4.25; 25 2.75,4.25; 26 2.25,4.25; 27 1.75,4.25; 28 1.25,4.25; 29 0.75,4.25; 30 0.25,4.25; 31 -0.25,4.25; 32 -0.75,4.25; 33 -1.25,4.25; 34 -1.75,4.25; 35 -2.25,4.25; 36 -2.75,4.25 | smd 1 x 0.254: 13 4.25,-2.75; 14 4.25,-2.25; 15 4.25,-1.75; 16 4.25,-1.25; 17 4.25,-0.75; 18 4.25,-0.25; 19 4.25,0.25; 20 4.25,0.75; 21 4.25,1.25; 22 4.25,1.75; 23 4.25,2.25; 24 4.25,2.75; 37 -4.25,2.75; 38 -4.25,2.25; 39 -4.25,1.75; 40 -4.25,1.25; 41 -4.25,0.75; 42 -4.25,0.25; 43 -4.25,-0.25; 44 -4.25,-0.75; 45 -4.25,-1.25; 46 -4.25,-1.75; 47 -4.25,-2.25; 48 -4.25,-2.75
SSOP20 = smd 1.422 x 0.356: 1 -2.845,2.936; 2 -2.845,2.276; 3 -2.845,1.615; 4 -2.845,0.98; 5 -2.845,0.32; 6 -2.845,-0.315; 7 -2.845,-0.98; 8 -2.845,-1.615; 9 -2.845,-2.276; 10 -2.845,-2.936; 11 2.845,-2.936; 12 2.845,-2.276; 13 2.845,-1.615; 14 2.845,-0.98; 15 2.845,-0.315; 16 2.845,0.32; 17 2.845,0.98; 18 2.845,1.615; 19 2.845,2.276; 20 2.845,2.936
TSSOP14_065 = smd 0.305 x 0.991: 1 -1.95,-2.718; 2 -1.3,-2.718; 3 -0.65,-2.718; 4 0,-2.718; 5 0.65,-2.718; 6 1.3,-2.718; 7 1.95,-2.718; 8 1.95,2.718; 9 1.3,2.718; 10 0.65,2.718; 11 0,2.718; 12 -0.65,2.718; 13 -1.3,2.718; 14 -1.95,2.718
TSSOP08 = smd 0.35 x 1.2: 1 -0.975,-2.925; 2 -0.325,-2.925; 3 0.325,-2.925; 4 0.975,-2.925; 5 0.975,2.925; 6 0.325,2.925; 7 -0.325,2.925; 8 -0.975,2.925
DBZ_R-PDSO-G3 = smd 0.7 x 1: 1 -0.95,-1.1; 2 0.95,-1.1; 3 0,1.1
WQP_PJ_301M6 = drill 1.016 pad 1.778 octagon: P1 0,-5.715; P2 0,-3.175; P3 0,4.445 | hole 2.2: 0,0
FIDUCIAL-1X2 = smd 1 x 1: 1 0,0
1X02 = drill 1.016 pad 1.88: 1 0,0; 2 2.54,0
1X04 = drill 1.016 pad 1.88 square: 1 0,0 | drill 1.016 pad 1.88: 2 2.54,0; 3 5.08,0; 4 7.62,0
2X5-SHROUDED = drill 1.016 pad 1.88 octagon: 1 -1.27,5.08; 2 1.27,5.08; 3 -1.27,2.54; 4 1.27,2.54; 5 -1.27,0; 6 1.27,0; 7 -1.27,-2.54; 8 1.27,-2.54; 9 -1.27,-5.08; 10 1.27,-5.08
L2012C = smd 0.9 x 1.25: 1 -0.9,0; 2 1,0
0603 = smd 0.85 x 0.7: 1 -0.9,0; 2 0.7,0
LED-BICOLOR-THROUGHHOLE-LUMEX = drill 0.7: A 0,0; GREEN_C 2.54,0; RED_C -2.54,0
CTS406 = smd 1.9 x 1.4: 1 -2.2,-1.2; 2 2.2,-1.2; 3 2.2,1.2; 4 -2.2,1.2
ALPS_POT_VERTICAL_PS = drill 1 pad 1.88 square: P$1 -2.5,7; P$2 0,7; P$3 2.5,7 | drill 1.5 pad 2.54 octagon: P$4 -4.7,0; P$5 4.7,0
R0402 = smd 0.65 x 0.75: 1 -0.6,0; 2 0.6,0
ALPS_POT_VERTICAL = drill 1 pad 1.88 square: P$1 -2.5,6.7; P$2 0,6.7; P$3 2.5,6.7 | drill 2.2 pad 3.175 octagon: P$4 -4.4,0; P$5 4.4,0
R0603 = smd 1 x 1.1: 1 -0.85,0; 2 0.85,0
TACTILE-PTH = drill 1.016 pad 1.88: 1 -3.251,2.261; 2 3.251,2.261; 3 -3.251,-2.261; 4 3.251,-2.261

### Placement (x,y rotation side)
C1  15.54,101.6 270 top
C2  17.76,101.6 270 top
C3  15.54,96.52 270 top
C4  45.06,96.52 180 top
C5  51.41,96.52 180 top
C6  18.08,95.57 90 top
C7  34.91,90.65 180 top
C8  34.11,87.47 90 top
C9  16.65,82.07 0 top
C10  16.65,80.8 0 top
C11  10.78,79.06 180 top
C12  46.97,79.06 180 top
C13  52.68,78.74 0 top
C14  5.7,78.11 180 top
C15  12.84,76.36 270 top
C16  37.76,75.41 180 top
C17  35.38,73.03 0 top
C18  37.76,73.02 0 top
C19  10.14,72.55 90 top
C20  11.41,72.55 90 top
C21  6.97,70.33 0 top
C22  51.89,69.53 180 top
C23  22.13,68.1 180 top
C24  22.13,66.83 180 top
C25  16.81,65.25 270 top
C26  17.92,65.25 270 top
C27  34.59,64.77 270 top
C28  40.94,63.98 0 top
C29  36.33,62.23 0 top
C30  40.94,60.8 90 top
C31  36.33,60.01 180 top
C32  9.51,51.75 180 top
C33  37.13,51.75 90 top
C34  48.24,51.75 180 top
C35  40.78,51.75 90 top
C36  9.19,49.21 180 top
C37  53,47.94 0 top
C38  6.01,47.62 90 top
C39  14.27,47.62 90 top
C40  26.65,47.62 90 top
C41  34.9,47.62 90 top
C42  45.06,47.31 90 top
C43  53.95,46.04 90 top
C44  26.02,45.72 180 top
C45  45.06,44.77 270 top
C46  6.01,43.81 270 top
C47  14.27,43.81 270 top
C48  26.65,43.81 270 top
C49  34.9,43.81 270 top
C50  41.89,42.86 180 top
C51  24.75,30.8 270 top
C52  44.11,30.8 270 top
C53  9.51,27.94 180 top
C54  46.81,14.76 270 top
C55  5.7,13.97 180 top
C56  19.03,13.97 0 top
C57  31.89,13.97 0 top
C58  49.83,13.97 180 top
C59  12.36,2.7 90 top
C60  35.06,2.7 90 top
C61  23.79,2.7 90 top
D1  40.62,100.97 90 top
D2  56.18,100.97 270 top
D3  25.7,57.63 90 top
H2  39.98,31.12 0 top
H3  19.03,31.11 0 top
IC1  6.97,100.33 270 top
IC2  37.76,82.55 0 top
IC3  51.26,74.93 0 top
IC4  18.39,73.66 270 top
IC5  38.72,68.26 90 top
IC6  10.14,45.72 270 top
IC7  30.78,45.72 270 top
IC8  49.51,45.72 270 top
IC9  41.1,45.4 0 top
J1  6.65,20.95 180 top
J2  18.08,20.95 180 top
J3  29.51,20.95 180 top
J4  40.94,20.95 180 top
J5  52.37,20.95 180 top
J6  6.65,6.35 180 top
J7  18.08,6.35 180 top
J8  29.51,6.35 180 top
J9  40.94,6.35 180 top
J10  52.37,6.35 180 top
JP1  1.89,104.78 0 top
JP2  57.13,104.78 0 top
JP3  1.89,2.54 0 top
JP4  57.13,2.54 0 top
JP5  2.52,54.61 270 bottom
JP6  2.52,85.09 90 bottom
JP8  48.24,102.23 90 bottom
L1  16.49,104.78 180 top
L2  40.62,97 90 top
L3  56.18,96.84 90 top
L4  31.89,90.49 270 top
L5  53.95,80.8 0 top
LED1  29.51,92.71 0 top
LED2  29.51,87.31 0 top
LED3  29.51,81.92 0 top
LED4  29.51,76.52 0 top
LED5  29.51,71.12 0 top
LED6  29.51,65.72 0 top
LED7  29.51,60.33 0 top
LED8  29.51,54.93 0 top
Q1  6.28,74.3 90 top
R1  11.41,88.27 180 top
R2  47.6,88.27 180 top
R3  35.86,87.31 0 top
R4  16.01,83.19 180 top
R5  10.78,75.09 180 top
R6  10.78,74.14 180 top
R7  10.14,60.96 180 top
R8  48.88,60.96 180 top
R9  5.22,55.24 90 top
R10  5.22,52.55 90 top
R11  38.24,51.75 90 top
R12  39.67,51.75 90 top
R13  37.45,48.9 90 top
R14  17.44,48.26 0 top
R15  23.48,48.26 180 top
R16  50.46,47.94 180 top
R17  4.74,47.62 270 top
R18  15.54,47.62 270 top
R19  25.38,47.62 270 top
R20  36.17,47.62 270 top
R21  42.52,47.31 90 top
R22  43.79,47.31 270 top
R23  23.48,46.99 180 top
R24  2.2,46.35 270 top
R25  3.47,46.35 270 top
R26  16.81,46.35 270 top
R27  37.45,46.35 270 top
R28  55.22,46.04 270 top
R29  23.48,44.45 180 top
R30  3.47,43.81 90 top
R31  4.74,43.81 90 top
R32  15.54,43.81 90 top
R33  16.81,43.81 90 top
R34  25.38,43.81 90 top
R35  36.17,43.81 90 top
R36  37.45,43.81 90 top
R37  43.79,43.5 270 top
R38  23.48,43.18 180 top
R39  37.45,41.59 270 top
R40  3.47,41.27 270 top
R41  16.81,41.27 270 top
R42  10.14,36.83 180 top
R43  29.51,36.83 180 top
R44  48.88,36.83 180 top
R45  35.54,13.65 270 top
R46  44.11,12.7 0 top
R47  55.54,12.7 0 top
R48  21.89,12.38 270 top
R49  25.7,12.38 270 top
R50  13.47,11.91 180 top
R51  23.48,11.11 90 top
SW1  25.06,100.33 0 top
SW2  33.95,100.33 0 top
U$1  [FCC_MEDIUM]  50.14,15.24 0 bottom
U$2  [ROHS_BIG]  39.19,7.62 0 bottom
U$3  [CE_MEDIUM]  50.46,7.62 0 bottom

### Tracks (layer width: path | path; a pad name or v marks a point on that pad's centre or on a via)
+3V3  (via drill 0.5)
  Top 0.254: IC5.17 37.76,71.08 37.76,70.33 37.45,70.01 36.02,70.01 35.78,70.25 IC5.20 | IC5.20 35.77,71.12 | IC5.20 35.78,71.36 | C25.1 C26.1 17.92,66.36 17.64,66.63 IC4.17 17.64,70.69 18.71,71.75 18.71,75.09 v19.19,75.56 | v16.01,75.56 15.64,75.93 | 15.64,75.93 IC4.48 15.64,79.8 16.01,80.17 16.01,80.77 C10.1 | v34.27,74.3 34.27,74.93 34.75,75.41 C16.+ 36.46,75.22 34.78,73.54 C17.1 34.9,72.9 34.9,72.71 35.78,71.83 IC5.20 | 17.8,94.97 C6.1 18.08,94.3 16.81,93.03 14.74,93.03 13.79,92.08 13.79,86.84 16.61,84.01 R4.1 16.05,82.62 C9.1 C10.1 | C10.1 | IC5.20 35.78,71.52 | v41.89,73.03 41.89,72.07 41.65,71.83 IC5.11 | 15.64,75.93 15.17,76.41 IC4.1
  Top 0.406: LED5.A 29.51,69.69 26.02,66.2 26.02,63.82 | LED6.A 27.6,63.82 26.02,63.82 | 26.02,63.82 26.02,59.69 26.8,58.91 D3.2 28.08,58.58 | LED7.A 29.51,59.37 28.71,58.58 28.08,58.58 | LED8.A 29.51,56.52 28.08,57.94 28.08,58.58
  Top 0.813: LED4.A LED3.A LED2.A 29.51,89.79 | IC1.3 10.14,97.79 12.71,95.22 C3.+ 15.84,94.92 15.89,94.97 C6.1 18.11,94.93 v21.57,94.93 21.55,94.92 | 29.51,89.79 L4.2 | LED1.A 29.51,89.79
  Bottom 0.254: v34.27,74.3 41.25,74.3 41.89,73.66 v41.89,73.03 | v19.19,75.56 v16.01,75.56
  Bottom 0.406: 29.51,74.3 v34.27,74.3
  Bottom 0.813: LED4.A 29.51,74.3 LED5.A | LED1.A 27.29,94.93 v21.57,94.93
+3V3_A  (via drill 0.5)
  Top 0.254: v14.59,67.47 14.59,63.5 12.64,61.55 R7.P$1 | IC5.1 34.63,65.42 C27.1 33.76,65.37 v33.32,64.93 | R1.P$1 13.79,81.15 13.79,79.69 11.89,77.79 9.51,77.79 7.6,79.69 3.79,79.69 2.68,78.58 2.68,70.33 5.06,67.94 9.19,67.94 10.14,68.9 v10.14,70.8 C19.1 C20.1 12.08,71.95 12.54,72.41 IC4.9 15.68,72.41 v16.01,72.07 | IC4.24 21.26,69.29 21.5,69.53 22.68,69.53 | v20.14,72.07 | 22.68,69.53 v20.14,72.07 | R7.P$1 12.68,53.92 | R7.P$1 12.64,52.19 9.79,49.34 C36.1 9.79,46.64 8.87,45.72 IC6.4 | IC4.25 22.68,70.87 22.68,69.53 | v22.52,65.56 22.73,65.77 C24.1 C23.1 22.68,68.15 22.68,69.53 | IC5.8 C28.1 | C44.1 IC7.4 v29.51,45.72
  Top 0.406: R8.P$1 51.41,54 v51.41,63.02 51.41,66.83 50.59,67.66 50.59,68.9 | 32.05,28.26 23.32,28.26 v20.46,25.4 | 32.05,28.26 50.78,28.26 51.38,28.85 R44.P$1 | R43.P$1 32.05,30.09 32.05,28.26 | v57.13,47.62 57.13,43.81 55.86,42.55 55.86,36.83 57.13,35.56 v57.13,34.61 | C30.+ 41.07,62.23 | v42.84,63.02 41.92,62.1 C30.+ | C28.1 40.3,63.94 40.3,63.5 40.94,62.87 C30.+ | 50.59,68.9 C22.+ | C22.+ 50.62,69.56 | R2.P$1 49.99,81.15 49.99,80.01 48.88,78.9 48.88,78.58 | 48.4,78.11 48.88,78.58 | 48.4,78.11 48.4,70.48 49.35,69.53 C22.+ | IC3.1 49.83,72.95 49.83,72.07 50.59,71.31 50.59,68.9 | 48.4,78.11 48.88,78.58
  Bottom 0.254: 33.79,65.41 v33.32,64.93 | v10.14,70.8 13.47,67.47 v14.59,67.47 | v29.51,45.72 29.51,37.47 32.01,34.97 R43.P$1 | v20.14,72.07 v16.01,72.07
  Bottom 0.356: 17.28,25.4 v20.46,25.4
  Bottom 0.406: v51.41,63.02 v42.84,63.02 40.46,65.41 33.79,65.41 32.36,66.83 24.75,66.83 23.48,65.56 v22.52,65.56 | R44.P$1 51.41,30.16 52.68,30.16 v57.13,34.61 | v57.13,47.62 57.13,50.8 53.97,53.96 R8.P$1 | 17.28,25.4 12.64,30.04 R42.P$1
ADC_FM
  Top 0.254: IC4.22 20.14,68.1 20.62,67.63 20.62,55.24 25.38,50.48 25.38,50.16 25.38,49.69 R19.1 C40.2 27.21,47.67 IC7.1
ADC_GATE
  Top 0.254: IC4.21 19.64,67.97 20.14,67.47 20.14,54.29 15.54,49.69 15.54,49.37 R18.1 C39.2 13.71,47.67 IC6.14
ADC_HARMONICS
  Top 0.254: C41.2 R20.1 | C41.2 34.9,48.26 | 33.48,48.27 32.35,48.27 28.4,52.23 26.33,52.23 23.48,55.09 23.48,63.02 24.9,64.45 24.9,66.52 26.02,67.63 26.02,70.48 24.09,72.41 IC4.28 | C41.2 34.85,48.27 33.48,48.27 | 33.48,48.27 33.49,48.26 IC7.14
ADC_MODEL  (via drill 0.5)
  Top 0.254: v11.73,43.02 11.25,43.5 11.25,48.1 12.68,49.53 14.11,49.53 19.19,54.61 | v9.19,43.02 9.19,43.18 8.6,43.77 IC6.7 6.57,43.77 C46.2 R31.1 | 19.19,54.61 19.19,59.37 19.19,67.15 18.64,67.69 IC4.19 | 19.19,54.61
  Bottom 0.254: v9.19,43.02 v11.73,43.02
ADC_MORPH
  Top 0.254: R35.1 C49.2 34.35,43.77 IC7.8 32.41,43.77 32.36,43.81 31.41,44.77 31.41,48.58 28.24,51.75 26.17,51.75 23,54.93 23,63.34 24.43,64.77 24.43,66.67 25.54,67.79 25.54,70.33 23.96,71.91 IC4.27
ADC_TIMBRE
  Top 0.254: IC4.20 19.14,67.83 19.66,67.31 19.66,54.45 15.22,50.01 14.74,49.53 14.27,49.05 12.84,49.05 11.73,47.94 11.73,47.62 11.73,44.13 12.09,43.77 IC6.8 13.36,43.77 13.92,43.22 C47.2 R32.1
ADC_TRIG  (via drill 0.5)
  Top 0.254: v7.28,50.16 7.42,50.02 IC6.1 6.92,47.67 6.33,48.26 6.33,48.23 C38.2 R17.1 | IC4.18 18.14,67.56 18.71,66.99 18.71,63.82 18.71,54.77 | v13.63,50.48 14.43,50.48 18.71,54.77 | 18.71,54.77
  Bottom 0.254: v7.28,50.16 7.6,50.48 v13.63,50.48
ADC_V_OCT
  Top 0.254: IC4.26 23.82,71.41 25.06,70.17 25.06,67.94 23.95,66.83 23.95,64.93 22.52,63.5 22.52,54.77 26.02,51.28 28.08,51.28 30.78,48.58 30.78,44.77 29.82,43.81 29.78,43.77 IC7.7 27.21,43.77 C48.2 R34.1
AREF_-10  (via drill 0.5)
  Top 0.254: v22.84,45.72 22.82,45.7 | v24.11,41.59 25.38,40.32 35.86,40.32 v36.17,40.64 | 4.73,45.7 v4.74,45.72 3.51,45.72 R25.2 R30.2 | R33.2 R26.2 16.77,45.72 v15.54,45.72 | R23.2 22.84,46.95 v22.84,45.72 | R29.2 22.84,44.48 v22.84,45.72 | R27.2 | R27.2 R36.2 | R27.2 37.41,45.72 v36.17,45.72 | R27.2 37.49,45.7 39.68,45.7 39.98,45.4 41.57,45.4 42.05,44.93 IC9.2 42.05,43.98 42.52,43.5 42.52,42.9 | 42.52,42.9 C50.1 | 42.52,42.9 R37.2
  Bottom 0.254: v24.11,41.59 22.84,42.86 v22.84,45.72 v15.54,45.72 14.27,44.45 6.01,44.45 v4.74,45.72 | v36.17,40.64 v36.17,45.72
DAC_BCK
  Top 0.254: IC5.13 40.3,71.08 40.3,70.17 38.71,68.58 35.86,68.58 | IC4.29 25.5,72.91 25.7,72.71 32.36,72.71 33.63,71.44 33.63,69.85 34.9,68.58 35.86,68.58 | 35.86,68.58 35.54,68.58 35.38,68.58
DAC_DIN
  Top 0.254: IC5.14 39.67,71.08 39.67,70.17 38.56,69.06 35.06,69.06 34.11,70.01 34.11,71.6 32.52,73.18 26.49,73.18 26.02,73.66 25.77,73.91 IC4.31
DAC_LRCK
  Top 0.254: IC5.15 39.03,70.17 38.4,69.53 35.22,69.53 34.59,70.17 34.59,71.75 32.68,73.66 26.65,73.66 26.17,74.14 | 26.17,74.14 | 26.17,74.14 25.9,74.41 IC4.32
FM_IN
  Top 0.254: 31.09,16.51 J3.P3 | 31.09,16.51 39.98,25.4 53.32,25.4 53.64,25.72 53.64,31.11 53.32,31.43 51.1,31.43 47.6,34.92 47.6,37.15 45.7,39.05 24.11,39.05 21.89,41.27 21.89,47.94 22.21,48.26 R15.2 | C57.1 31.09,14.03 31.09,16.51
FREQ_ATT  (via drill 0.5)
  Top 0.254: R43.P$2 29.51,31.43 28.24,32.7 24.75,32.7 | C51.1 24.75,32.7 | v20.93,52.86 20.3,52.23 20.3,37.15 24.75,32.7 | v16.49,57.63 17.28,58.42 17.28,61.91 15.54,63.66 15.54,66.52 16.64,67.62 IC4.15
  Bottom 0.254: v20.93,52.86 19.03,52.86 16.49,55.4 v16.49,57.63
FREQ_POT
  Top 0.254: IC4.10 12.84,71.91 12.36,71.44 12.36,70.48 9.35,67.47 4.9,67.47 2.2,70.17 2.2,78.74 6.33,82.87 11.09,82.87 11.41,82.55 R1.P$2 11.41,79.09 C11.1
GATE_IN
  Top 0.254: R14.2 18.04,47.59 17.76,47.31 17.76,39.21 17.6,39.05 17.6,35.72 14.9,33.02 14.9,27.94 10.78,23.81 10.78,15.88 10.14,15.24 10.14,11.11 9.82,10.79 5.38,10.79 4.43,9.84 4.43,5.08 6.33,3.17 9.51,3.17 11.41,5.08 14.9,5.08 J7.P3 18.13,1.85 C61.1
GATE_IN1
  Top 0.254: R24.2 2.2,45.24 2.68,44.77 2.68,33.97 3.47,33.18 3.47,5.08 J6.P3 7.76,1.91 8.24,2.38 9.66,2.38 10.2,1.85 C59.1
GND  (via drill 0.5)
  Top 0.254: 26.49,56.82 26.49,56.83 26.64,56.83 D3.1
  other vias: 30.78,88.58 36.81,88.9 34.9,81.6 36.81,63.82 14.27,45.72 39.51,72.71 42.84,65.72 40.94,57.47 35.54,58.42 24.11,45.72 34.9,45.72 43.79,45.4 53.64,49.21 9.03,72.55 27.92,105.41 18.08,97.47 53.95,44.13 49.35,75.09 54.43,64.14 7.44,78.26 5.22,70.33 6.17,45.72 29.82,46.99 17.76,63.34 19.35,71.12 21.57,64.61 23.63,69.22 21.57,57.78 24.11,49.85 18.71,51.44 21.73,40 17.76,55.88 15.86,53.98 16.81,79.38 20.3,76.2 9.82,41.59 39.98,42.86 40.62,91.44 23.48,91.44 13.63,59.05 12.36,66.52 19.66,73.34 31.09,67.94 31.09,64.45 1.25,7.62 1.25,17.78 1.25,27.94 1.25,38.1 1.25,99.06 7.6,105.41 19.03,105.41 38.08,105.41 57.76,88.9 42.52,82.23 48.56,58.74 57.76,78.74 57.76,64.14 57.76,58.42 57.76,38.1 57.76,27.94 57.76,17.78 57.76,7.62 8.87,1.27 27.92,1.27 38.08,1.27 48.24,1.27 20.93,93.34 48.56,64.77 50.46,58.74 35.54,53.5 40.94,53.5 17.12,85.72 18.39,92.71 16.81,73.03 51.89,43.18 49.51,46.35 10.3,76.2 13,100.33 22.68,51.28 8.87,46.99 7.6,51.75 9.82,45.4 13.95,24.13 40.94,75.25 40.62,73.34 50.46,64.77 23.48,82.55 26.81,53.34 24.9,61.59 27.92,50.01 49.35,76.36 54.11,75.09 54.11,73.82 54.11,76.36 49.35,77.63 54.11,72.55 54.11,71.28 52.84,71.28 51.57,71.28
  pour Top: 59.03,106.68 59.03,0 -0.02,0 -0.02,106.68
  pour Bottom: 59.03,106.68 59.03,0 -0.02,0 -0.02,106.68
HARMONICS_IN  (via drill 0.5)
  Top 0.254: v39.03,41.27 39.35,40.96 46.65,40.96 49.51,38.1 49.51,35.88 52.05,33.34 54.27,33.34 55.54,32.07 55.54,18.1 53.95,16.51 J5.P3 52.37,15.66 C58.1 | 37.48,49.53 R13.2 37.8,49.49 38.24,49.05 38.24,47.78 v39.03,46.99
  Bottom 0.254: v39.03,41.27 v39.03,46.99
HARMONICS_POT  (via drill 0.5)
  Top 0.254: IC4.12 14.14,70.68 13.79,70.33 13.47,70.33 9.66,66.52 4.58,66.52 1.25,69.85 1.25,79.06 7.28,85.09 v12.68,85.09 | v24.59,85.09 24.59,93.82 26.33,95.57 38.08,95.57 40.62,93.03 42.21,93.03 45.86,89.38 45.86,85.25 47.6,83.5 R2.P$2 47.6,79.09 C12.1
  Bottom 0.254: v12.68,85.09 13.47,85.09 14.11,84.45 23.95,84.45 v24.59,85.09
LEDS_SCK
  Top 0.254: 35.54,79.77 IC2.3 35.54,77.15 35.54,76.83 34.43,75.72 32.84,74.14 26.81,74.14 26.33,74.61 26.04,74.91 IC4.33
LEDS_SIN
  Top 0.254: IC4.35 25.67,75.91 26.97,74.61 32.68,74.61 33.95,75.88 34.9,76.83 IC2.2
LEDS_SS  (via drill 0.5)
  Top 0.254: 26.65,75.56 27.13,75.09 29.67,75.09 30.62,75.09 32.52,75.09 33.48,76.04 | 26.65,75.56 | 26.65,75.56 25.8,76.41 IC4.36 | 33.48,76.04 | 33.48,76.04 33.95,76.52 v33.95,77.47 | v36.65,77.47 36.17,77.95 IC2.4
  Bottom 0.254: v33.95,77.47 v36.65,77.47
MODEL_IN
  Top 0.254: R40.2 3.47,33.97 4.11,33.34 4.11,19.05 J1.P3 6.65,14.07 C55.1
MORPH_ATT  (via drill 0.5)
  Top 0.254: R44.P$2 48.88,31.43 47.92,32.38 44.11,32.38 | 44.11,32.38 C52.1 | v15.38,56.83 15.38,57.94 16.81,59.37 | 16.81,59.37 | 16.81,59.37 16.81,61.75 15.06,63.5 15.06,66.67 16.14,67.76 IC4.14 | v21.41,51.75 20.78,51.12 20.78,37.78 24.9,33.66 42.84,33.66 44.11,32.38
  Bottom 0.254: v21.41,51.75 20.78,51.75 20.14,52.39 18.87,52.39 16.01,55.24 16.01,56.2 v15.38,56.83 | v15.38,56.83 15.54,56.67 | v15.38,56.83
MORPH_IN
  Top 0.254: J4.P3 46.81,16.51 | 46.81,16.51 50.46,16.51 51.73,17.78 53,17.78 54.91,19.68 54.91,31.75 53.95,32.7 51.73,32.7 48.88,35.56 48.88,37.78 46.33,40.32 38.71,40.32 38.04,40.99 R39.2 | C54.1 | 46.81,16.51 C54.1
MORPH_POT  (via drill 0.5)
  Top 0.254: IC4.11 13.13,71.41 12.84,71.12 12.84,70.33 9.51,66.99 4.74,66.99 1.73,70.01 1.73,78.9 7.44,84.61 11.73,84.61 12.36,83.98 v13.32,83.98 | v25.54,83.98 25.54,85.57 25.06,86.04 25.06,93.66 26.49,95.09 37.92,95.09 40.46,92.55 42.05,92.55 45.38,89.22 45.38,86.68 43.48,84.77 43.48,80.01 47.29,76.2 47.29,69.85 49.51,67.63 49.51,56.2 48.88,55.56 R8.P$2 48.88,51.79 C34.1
  Bottom 0.254: v13.32,83.98 23,83.98 | 23,83.98 | 23,83.98 v25.54,83.98
N$1
  Top 0.61: 15.49,103.05 L1.2
  Top 0.813: 15.49,103.05 C1.1 15.41,102.87 IC1.1
N$2
  Top 0.254: 45.06,56.67 47.13,58.74 47.13,68.26 45.7,69.69 45.7,75.56 41.44,79.83 IC2.12 | 45.06,56.67 | 45.06,56.67 43.79,55.4 34.75,55.4 34.27,54.93 LED8.GREEN_C
N$3
  Top 0.254: J6.P2 10.78,9.53 12.87,11.62 R50.2
N$4
  Top 0.254: R24.1 R25.1 3.54,47.02 R17.2 C38.1 IC6.2
N$5
  Top 0.254: LED8.RED_C 28.24,53.66 32.05,53.66 32.84,54.45 34.43,54.45 34.9,54.93 43.95,54.93 44.91,55.88 45.22,56.2 47.6,58.58 47.6,68.42 46.18,69.85 46.18,75.72 42.05,79.85 42.05,80.49 41.89,80.64 40.94,80.64 40.62,80.33 IC2.11
N$6
  Top 0.254: C29.1 35.54,62.39 35.54,63.82 36.02,64.29 36.44,64.72 IC5.2
N$7
  Top 0.254: R5.1 | R5.1 11.89,75.09 12.36,74.61 13.32,74.61 13.52,74.41 IC4.5
N$8
  Top 0.254: R6.1 | R6.1 13.16,74.14 13.38,73.91 IC4.6
N$9
  Top 0.254: 39.98,79.77 IC2.10 39.98,79.06 40.14,78.9 41.73,78.9 45.22,75.41 45.22,69.53 46.65,68.1 46.65,58.9 43.64,55.88 34.9,55.88 32.05,58.74 LED7.GREEN_C
N$10
  Top 0.254: LED7.RED_C 27.92,61.28 32.52,61.28 33,60.8 33,58.58 35.22,56.36 43.48,56.36 45.54,58.42 46.18,59.05 46.18,67.94 44.75,69.37 44.75,75.25 41.57,78.42 39.83,78.42 39.35,78.9 IC2.9
N$11
  Top 0.254: LED6.GREEN_C 33,66.67 39.35,66.67 41.1,68.42 42.68,68.42 44.27,70.01 44.27,75.09 41.41,77.95 39.67,77.95 38.71,78.9 IC2.8
N$12
  Top 0.254: LED4.RED_C 27.92,75.56 29.51,75.56 30.46,75.56 32.36,75.56 33,76.2 33,80.33 33.95,81.28 33.95,82.23 34.27,82.55 39.83,82.55 41.25,83.98 IC2.13
N$13
  Top 0.254: LED6.RED_C 30.14,68.9 32.68,68.9 34.43,67.15 39.19,67.15 40.94,68.9 42.52,68.9 43.79,70.17 43.79,74.93 41.25,77.47 39.19,77.47 38.08,78.58 IC2.7
N$14
  Top 0.254: LED4.GREEN_C 32.05,80.01 33.48,81.44 33.48,82.39 34.11,83.03 39.51,83.03 40.62,84.14 IC2.14
N$15
  Top 0.254: LED5.GREEN_C 32.68,70.48 32.68,69.53 34.59,67.63 39.03,67.63 40.78,69.37 42.37,69.37 43.32,70.33 43.32,74.77 41.1,76.99 39.03,76.99 37.45,78.58 IC2.6
N$16
  Top 0.254: C29.2 37.29,63.02 37.73,63.47 IC5.4
N$17  (via drill 0.5)
  Top 0.254: v31.09,80.33 31.73,80.33 33,81.6 33,82.55 33.95,83.5 39.19,83.5 39.98,84.3 IC2.15
  Bottom 0.254: v31.09,80.33 28.55,80.33 LED3.RED_C
N$18
  Top 0.254: LED3.GREEN_C 32.05,82.23 33.79,83.98 38.87,83.98 39.35,84.45 IC2.16
N$19
  Top 0.254: LED2.RED_C 26.97,91.12 26.02,92.08 26.02,93.03 27.13,94.14 36.97,94.14 38.87,92.23 38.87,86.68 38.74,86.54 38.71,86.52 IC2.17
N$20
  Top 0.254: LED2.GREEN_C 32.05,85.72 33.32,84.45 37.45,84.45 37.92,84.45 38.08,84.61 IC2.18
N$21
  Top 0.254: LED1.RED_C 27.92,93.66 36.81,93.66 38.4,92.08 38.4,87 37.45,86.04 IC2.19
N$22
  Top 0.254: LED5.RED_C 28.08,72.23 32.21,72.23 33.16,71.28 33.16,69.69 34.75,68.1 38.87,68.1 40.62,69.85 42.21,69.85 42.84,70.48 42.84,74.61 40.94,76.52 38.87,76.52 36.81,78.58 IC2.5
N$23
  Top 0.254: LED1.GREEN_C 36.97,92.71 37.13,92.71 37.92,91.92 37.92,87.15 36.81,86.04 IC2.20
N$24
  Top 0.254: J3.P2 25.7,20.32 R49.1
N$25
  Top 0.254: J2.P2 21.89,20.32 R48.1
N$26
  Top 0.254: J4.P2 35.54,18.73 R45.1
N$27
  Top 0.254: IC2.24 34.27,86.04 34.11,86.2 C8.1
  Top 0.406: C8.1 33.99,87 33.63,87 33,87.63 33,89.22 33.6,89.82 C7.+
  Top 0.813: C7.+ 32.86,91.39 L4.1
N$28
  Top 0.254: R14.1 16.84,46.99 R26.1 15.61,46.95 R18.2 C39.1 | C39.1 14.23,46.99 | IC6.13 C39.1
N$29
  Top 0.254: R5.2 5.54,75.09 5.08,75.55 Q1.3 5.1,76.52 C14.2
N$30
  Top 0.254: R38.1 R29.1 24.07,44.41 R34.2 C48.1 26.68,44.45 26.71,44.42 IC7.6
N$31  (via drill 0.5)
  Top 0.254: v9.82,16.51 10.3,16.99 10.3,24.13 14.43,28.26 14.43,33.34 16.97,35.88 16.97,39.05 16.81,39.21 R41.2 | C56.1 18.08,14.07 J2.P3
  Bottom 0.254: v9.82,16.51 J2.P3
N$32
  Top 0.254: C49.1 R35.2 36.24,44.41 R36.1 R39.1 | C49.1 34.87,44.45 | R39.1 | IC7.9 C49.1
N$33
  Top 0.254: 5.1,52.07 R10.1 2.64,51.95 JP5.2
N$34
  Top 0.254: R15.1 R23.1 24.11,47.02 R19.2 C40.1 IC7.2
N$35
  Top 0.254: R6.2 7.92,74.14 7.44,73.66 7.44,72.14 Q1.1 7.48,70.41 C21.2
N$36
  Top 0.254: J7.P2 20.3,9.53 21.29,10.51 R51.1
N$37
  Top 0.254: R40.1 R30.1 4.67,44.41 R31.2 C46.1 6.05,44.45 6.08,44.42 IC6.6
N$38
  Top 0.406: L3.2 D2.A
N$39
  Top 0.254: R41.1 R33.1 16.74,43.22 R32.2 C47.1 14.23,44.45 14.2,44.42 IC6.9
N$40
  Top 0.406: L5.2 54.59,80.87 54.59,89.22 52.68,91.12 45.38,91.12 41.57,94.93 40.3,94.93 39.67,95.57 39.67,97.16 40.21,97.7 L2.2
  Top 0.61: L2.2 D1.C 39.34,99.06 38.08,100.33 21.89,100.33 19.03,103.19 17.95,103.19 C2.1 | 17.49,103.27 17.39,103.37 L1.1
  Top 0.813: 17.49,103.27 C2.1
N$41
  Top 0.254: C41.1 R20.2 36.24,46.95 R27.1 R13.1 | C41.1 34.87,46.99 | IC7.13 C41.1
N$42
  Top 0.406: 51.41,78.74 C13.1 51.41,78.74 | 51.41,78.74 51.41,79.69 52.53,80.8 L5.1 | IC3.3 52.68,73.02 52.68,74.3 53,74.61 53,77.15 51.41,78.74
N$43  (via drill 0.5)
  Top 0.254: IC5.6 39.03,64.29 38.71,63.98 38.71,58.1 v38.24,57.63 | R11.2 v38.24,53.66
  Bottom 0.254: v38.24,53.66 v38.24,57.63
N$46
  Top 0.254: R21.2 42.08,47.91 42.05,47.94 41.73,47.94 39.19,50.48 38.56,50.48 38.24,50.8 R11.1 C33.1
N$47
  Top 0.254: R16.2 46.65,47.94 46.02,48.58 41.89,48.58 39.67,50.8 R12.1 C35.1
N$48
  Top 0.254: IC5.5 38.4,64.45 38.24,64.29 38.24,61.28 38.08,61.12 37.6,61.12 37.28,60.8 C31.1
N$51
  Top 0.254: 5.18,54.61 R9.1 2.56,54.65 JP5.1
N$54
  Top 0.254: 37.11,71.12 IC5.18 37.1,72.96 C18.1
N$55  (via drill 0.5)
  Top 0.254: IC5.7 39.67,65.39 39.67,64.14 39.19,63.66 39.19,58.1 v39.67,57.63 | R12.2 v39.67,53.66
  Bottom 0.254: v39.67,53.66 v39.67,57.63
N$56
  Top 0.61: JP8.9 43.16,102.87 | 43.16,102.87 JP8.10 | D1.A 43.16,102.87
N$58
  Top 0.254: R28.2 C43.1 53.91,45.4 IC8.6 52.43,45.4 51.73,45.4 51.06,46.07 R16.1
N$60
  Top 0.254: IC8.7 53.01,46.05 53.64,46.67 53.92,46.67 C43.2 R28.1 55.89,46.64 56.18,46.35 56.18,44.45 54.91,43.18 53.32,43.18 50.78,40.64 50.78,36.51 52.68,34.61 54.91,34.61 56.81,32.7 56.81,17.46 56.39,17.04 R47.2
N$62
  Top 0.254: R21.1 R22.2 C42.1 45.73,46.05 IC8.2
N$63
  Top 0.254: R22.1 C42.2 45.1,47.94 45.7,47.94 46.58,47.06 IC8.1 47.9,46.7 48.24,46.35 48.24,40.32 50.14,38.42 50.14,36.2 52.37,33.97 54.59,33.97 56.18,32.38 56.18,17.78 51.1,12.7 R46.2
N$64
  Top 0.406: D2.C 54.91,102.87 54.27,103.5 JP8.2 JP8.1
N$65
  Top 0.254: J9.P3 43.26,4.23 R46.1
N$68
  Top 0.254: R3.1 35.22,87.28 35.22,86.68 34.9,86.36 IC2.23
N$69
  Top 0.254: J10.P3 54.69,4.23 R47.1
NORMALIZATION_PROBE  (via drill 0.5)
  Top 0.254: v26.97,69.37 26.49,68.9 26.49,67.47 25.38,66.36 25.38,63.5 23.95,62.07 23.95,58.9 24.6,58.25 D3.3 24.59,57.62 24.59,56.2 25.38,55.4 v25.38,54.61 | v20.93,73.5 21.03,73.41 IC4.30 | v18.87,49.85 19.35,49.37 19.35,35.4 16.49,32.54 16.49,23.18 13.95,20.64 13.95,12.03 R50.1 15.22,11.91 16.33,10.79 20.3,10.79 21.29,11.78 R48.2 21.96,11.71 R51.2 23.55,11.78 R49.2 25.73,11.75 26.65,11.75 27.6,10.79 34.11,10.79 35.54,12.22 R45.2 | v25.38,54.61
  Bottom 0.254: v18.87,49.85 22.52,49.85 25.38,52.7 v25.38,54.61 | v20.93,73.5 22.36,73.5 24.11,71.75 25.7,70.17 26.49,69.37 v26.97,69.37
RESET  (via drill 0.5)
  Top 0.254: v15.86,73.98 15.29,73.41 IC4.7 | C15.1 14.07,76.96 v14.43,77.31 14.43,77.47 15.06,78.11 15.06,80.01 15.38,80.33 15.38,83.15 R4.2 15.41,84.26 15.22,84.45 13.32,86.36 13.32,90.17 10.78,92.71 JP6.4
  Bottom 0.254: v15.86,73.98 14.43,75.41 v14.43,77.31
RX
  Top 0.254: IC4.46 16.64,76.68 17.76,75.56 17.76,72.23 16.65,71.12 15.62,71.12 14.35,69.85 13.63,69.85 7.28,63.5 7.28,59.69 5.22,57.63 R9.2
SW_1
  Top 0.254: SW1.3 SW1.4 27.56,98.07 20.93,91.44 19.66,91.44 18.71,90.49 18.71,90.17 18.71,89.53 18.71,79.38 18.14,78.81 IC4.43
SW_2
  Top 0.254: SW2.4 SW2.3 28.68,96.04 26.17,96.04 21.09,90.96 19.82,90.96 19.19,90.33 19.19,79.22 | IC4.42 18.64,78.67 19.19,79.22 | 19.19,79.22
SWCLK  (via drill 0.5)
  Top 0.254: v21.73,88.27 21.78,88.21 21.14,87.58 IC4.37
  Bottom 0.254: v21.73,88.27 19.35,88.27 17.12,90.49 4.27,90.49 3.95,90.17 JP6.3
SWDIO  (via drill 0.5)
  Top 0.254: IC4.34 21.73,75.41 21.41,75.72 21.41,76.68 21.73,76.99 21.73,86.52 v22.36,87.15
  Bottom 0.254: 5.22,90.01 | 5.22,90.01 16.81,90.01 19.03,87.79 20.93,87.79 21.57,87.15 v22.36,87.15 | 5.22,90.01 2.84,87.63 JP6.2
TIMBRE_ATT
  Top 0.254: IC4.16 17.14,67.49 16.01,66.36 16.01,63.82 17.76,62.07 17.76,57.47 17.44,57.15 | 17.44,57.15 | 17.44,57.15 14.11,53.82 14.11,53.02 10.78,49.69 10.78,48.9 10.78,35.24 10.14,34.61 R42.P$2 10.14,27.98 C53.1
TIMBRE_POT
  Top 0.254: IC4.13 15.64,68.85 15.22,68.42 14.27,68.42 13.47,67.63 13.47,65.88 10.14,62.55 R7.P$2 10.14,51.79 C32.1
TX
  Top 0.254: 17.12,77.89 IC4.45 17.14,76.81 18.24,75.72 18.24,71.91 | 18.24,71.91 16.97,70.64 15.78,70.64 14.51,69.37 13.79,69.37 7.76,63.34 7.76,59.37 6.17,57.78 6.17,53.5 5.82,53.15 R10.2 | 18.24,71.91
V_OCT_IN
  Top 0.254: R38.2 22.82,43.18 22.82,41.61 24.75,39.69 46.02,39.69 48.24,37.47 48.24,35.24 51.41,32.07 53.64,32.07 54.27,31.43 54.27,20 52.68,18.41 51.41,18.41 50.14,17.14 42.21,17.14 41.57,17.78 39.98,17.78 39.35,17.14 39.35,14.29 38.08,13.02 38.08,3.81 36.12,1.85 C60.1 29.56,1.85 J8.P3
VCC
  Top 0.254: IC8.8 52.35,46.78 52.4,46.83 C37.1 | 43.48,96.52 C4.+
  Top 0.406: 43.48,96.52 43.48,93.98 45.7,91.76 53,91.76 55.54,89.22 55.54,53.02 52.4,49.88 C37.1 | L2.1 40.73,96.2 41.57,96.2 41.89,96.52 C4.+
VEE  (via drill 0.5)
  Top 0.254: IC8.4 46.58,44.38 46.33,44.13 45.1,44.13 C45.2 | v45.06,42.86 C45.2 | R37.1 43.86,44.17 C45.2
  Top 0.406: C5.- 53,96.51 | v55.22,48.58 55.22,51.75 56.18,52.7 56.18,89.53 53,92.71 53.01,92.72 C5.- | C5.- 54.27,96.52 54.85,95.94 L3.1
  Bottom 0.406: v55.22,48.58 49.51,42.86 v45.06,42.86

### Text on the board
bNames: +12V | GND | GND | GND | -12V | Red Stripe | Plaits | cc-by-sa Émilie Gillet | 2017. v5
tStop: Plaits | cc-by-sa | 2017. v5 | Émilie Gillet